# Altium project IMX6ULL_CORE.PrjPcb (part 1 of 2)
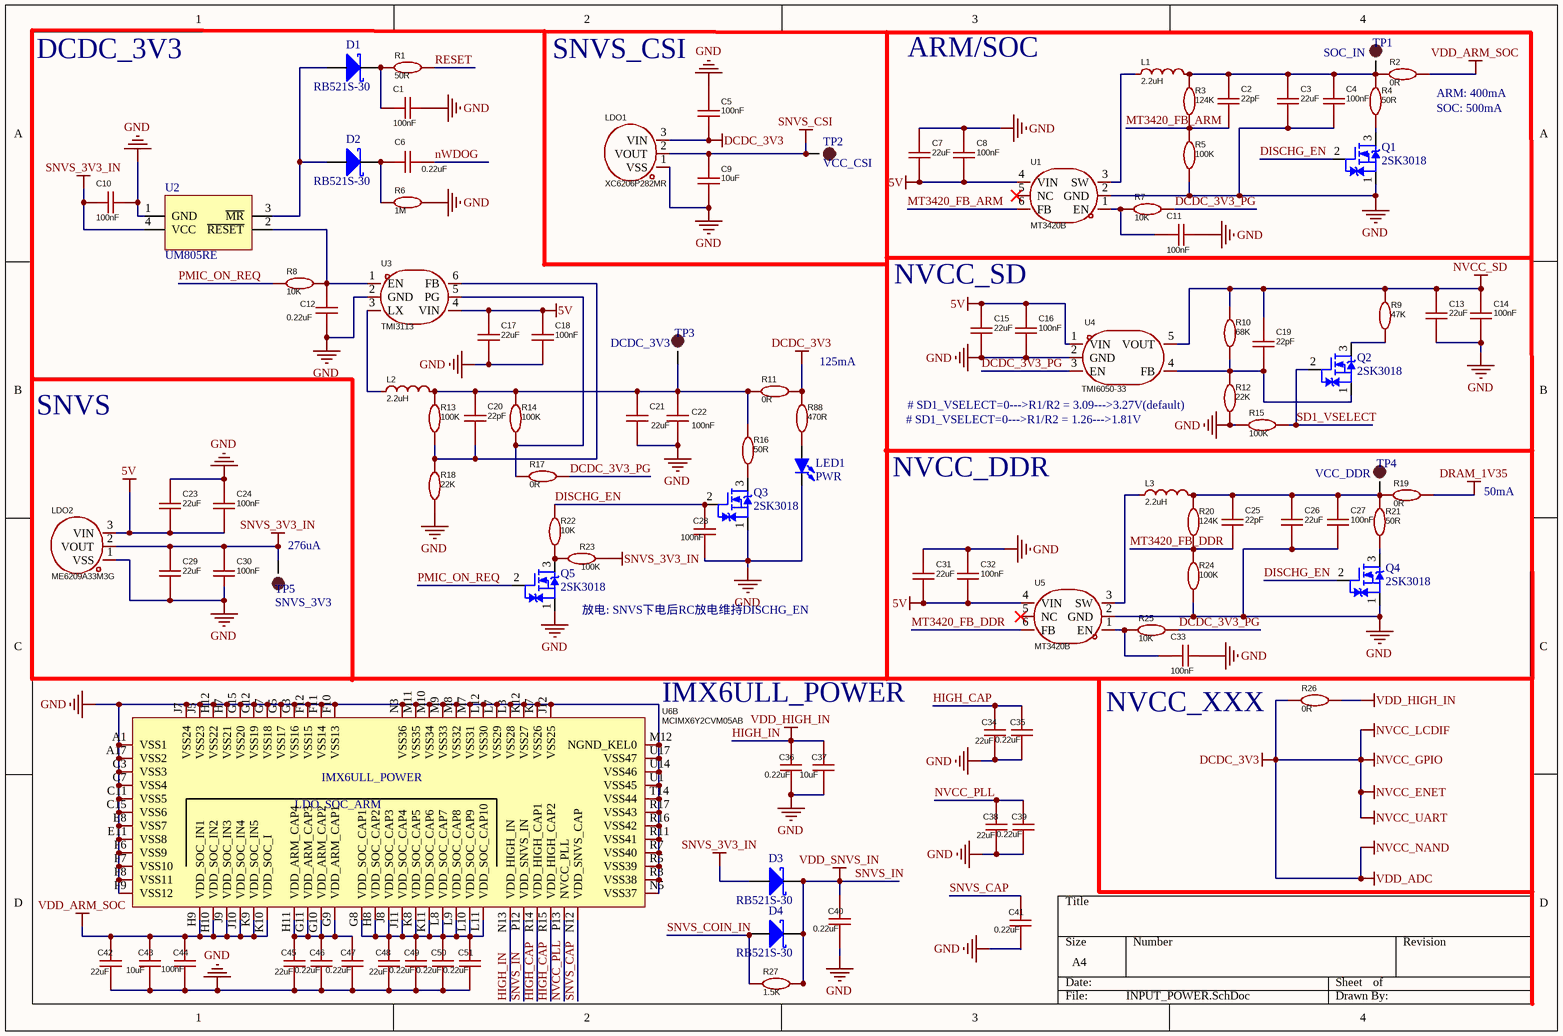
[diagram p0: INPUT_POWER.SchDoc]
5 sheets, 235 parts. Net scope: global (net labels, ports and power ports of the same name join across sheets).
Board file: PCB1.PcbDoc
Sheets:
  INPUT_POWER.SchDoc
  MX6ULL_DDR.SchDoc
  FLASH_CSI.SchDoc
  LCD_NET_GPIO_JTAG_SD_USB.SchDoc
  UART_CONTROL.SchDoc

## Sheet INPUT_POWER.SchDoc
size A4; SheetNumber: 1; SheetTotal: 5

### Parts
C1  100nF  [C0402]
C2  22pF  [C0402]
C3  22uF  [C0603]
C4  100nF  [C0402]
C5  100nF  [C0402]
C6  0.22uF  [C0402]
C7  22uF  [C0603]
C8  100nF  [C0402]
C9  10uF  [C0402]
C10  100nF  [C0402]
C11  100nF  [C0402]
C12  0.22uF  [C0402]
C13  22uF  [C0603]
C14  100nF  [C0402]
C15  22uF  [C0603]
C16  100nF  [C0402]
C17  22uF  [C0603]
C18  100nF  [C0402]
C19  22pF  [C0402]
C20  22pF  [C0402]
C21  22uF  [C0603]
C22  100nF  [C0402]
C23  22uF  [C0603]
C24  100nF  [C0402]
C25  22pF  [C0402]
C26  22uF  [C0603]
C27  100nF  [C0402]
C28  100nF  [C0402]
C29  22uF  [C0603]
C30  100nF  [C0402]
C31  22uF  [C0603]
C32  100nF  [C0402]
C33  100nF  [C0402]
C34  22uF  [C0603]
C35  0.22uF  [C0402]
C36  0.22uF  [C0402]
C37  10uF  [C0402]
C38  22uF  [C0603]
C39  0.22uF  [C0402]
C40  0.22uF  [C0402]
C41  0.22uF  [C0402]
C42  22uF  [C0603]
C43  10uF  [C0402]
C44  100nF  [C0402]
C45  22uF  [C0603]
C46  0.22uF  [C0402]
C47  0.22uF  [C0402]
C48  22uF  [C0603]
C49  0.22uF  [C0402]
C50  0.22uF  [C0402]
C51  0.22uF  [C0402]
D1  RB521S-30  [SOD-523]
D2  RB521S-30  [SOD-523]
D3  RB521S-30  [SOD-523]
D4  RB521S-30  [SOD-523]
L1  2.2uH  [IND-SMD_L2.5-W2.0_MHCHL2520]
L2  2.2uH  [IND-SMD_L2.5-W2.0_MHCHL2520]
L3  2.2uH  [IND-SMD_L2.5-W2.0_MHCHL2520]
LDO1  XC6206P282MR  [SOT-23-3_L2.9-W1.6-P1.90-LS2.8-BR]
LDO2  ME6209A33M3G  [SOT-23-3_L2.9-W1.6-P1.90-LS2.8-BR]
LED1  PWR  [LED 0603B]
Q1  2SK3018  [SC70-3N]
Q2  2SK3018  [SC70-3N]
Q3  2SK3018  [SC70-3N]
Q4  2SK3018  [SC70-3N]
Q5  2SK3018  [SC70-3N]
R1  50R  [R0402]
R2  0R  [R0402]
R3  124K  [R0402]
R4  50R  [R0402]
R5  100K  [R0402]
R6  1M  [R0402]
R7  10K  [R0402]
R8  10K  [R0402]
R9  47K  [R0402]
R10  68K  [R0402]
R11  0R  [R0402]
R12  22K  [R0402]
R13  100K  [R0402]
R14  100K  [R0402]
R15  100K  [R0402]
R16  50R  [R0402]
R17  0R  [R0402]
R18  22K  [R0402]
R19  0R  [R0402]
R20  124K  [R0402]
R21  50R  [R0402]
R22  10K  [R0402]
R23  100K  [R0402]
R24  100K  [R0402]
R25  10K  [R0402]
R26  0R  [R0402]
R27  1.5K  [R0402]
R88  470R  [R0402]
TP1  SOC_IN  [TP-1.0]
TP2  VCC_CSI  [TP-1.0]
TP3  DCDC_3V3  [TP-1.0]
TP4  VCC_DDR  [TP-1.0]
TP5  SNVS_3V3  [TP-1.0]
U1  MT3420B  [SOT-23-6_L2.9-W1.6-P0.95-LS2.8-BL]
U2  UM805RE  [SOT143]
U3  TMI3113  [SOT-23-6_L2.9-W1.6-P0.95-LS2.8-BL]
U4  TMI6050-33  [SOT-23-5_L2.9-W1.6-P0.95-LS2.8-BR]
U5  MT3420B  [SOT-23-6_L2.9-W1.6-P0.95-LS2.8-BL]
U6  MCIMX6Y2CVM05AB  [BGA-289_L14.0-W14.0-R17-C17-P0.80-BL]  (part B of 12)

### Nets
5V: C7.1 C8.1 C15.2 C16.2 C17.2 C18.2 C23.1 C24.1 C31.1 C32.1 LDO2.3(VIN) U1.4(VIN) U3.4(VIN) U4.1(VIN) U5.4(VIN)
DCDC_3V3: C5.2 LDO1.3(VIN) R11.2 R26.1 R88.2  [also labelled NVCC_ENET, NVCC_GPIO, NVCC_LCDIF, NVCC_NAND, NVCC_UART, VDD_ADC]
DRAM_1V35: R19.2
GND: C1.1 C3.1 C4.1 C5.1 C7.2 C8.2 C9.1 C10.1 C11.1 C12.2 C13.1 C14.1 C15.1 C16.1 C17.1 C18.1 C21.1 C22.1 C23.2 C24.2 C26.1 C27.1 C28.1 C29.1 C30.1 C31.2 C32.2 C33.1 C34.1 C35.1 C36.1 C37.1 C38.1 C39.1 C40.1 C41.1 C42.1 C43.1 C44.1 C45.1 C46.1 C47.1 C48.1 C49.1 C50.1 C51.1 LDO1.1(VSS) LDO2.1(VSS) LED1.2(K) Q1.1(S) Q3.1(S) Q4.1(S) Q5.1(S) R5.2 R6.2 R12.2 R15.1 R18.1 R24.2 U1.2(GND) U2.1(GND) U3.2(GND) U4.2(GND) U5.2(GND) U6.A1(VSS1) U6.A17(VSS2) U6.C3(VSS3) U6.C7(VSS4) U6.C11(VSS5) U6.C15(VSS6) U6.E8(VSS7) U6.E11(VSS8) U6.F6(VSS9) U6.F7(VSS10) U6.F8(VSS11) U6.F9(VSS12) U6.F10(VSS13) U6.F11(VSS14) U6.F12(VSS15) U6.G3(VSS16) U6.G5(VSS17) U6.G7(VSS18) U6.G12(VSS19) U6.G15(VSS20) U6.H7(VSS21) U6.H12(VSS22) U6.J5(VSS23) U6.J7(VSS24) U6.J12(VSS25) U6.K7(VSS26) U6.K12(VSS27) U6.L3(VSS28) U6.L7(VSS29) U6.L12(VSS30) U6.M7(VSS31) U6.M8(VSS32) U6.M9(VSS33) U6.M10(VSS34) U6.M11(VSS35) U6.M12(NGND_KEL0) U6.N3(VSS36) U6.N5(VSS37) U6.R3(VSS38) U6.R5(VSS39) U6.R7(VSS40) U6.R11(VSS41) U6.R16(VSS42) U6.R17(VSS43) U6.T14(VSS44) U6.U1(VSS45) U6.U14(VSS46) U6.U17(VSS47)
HIGH_IN: C36.2 C37.2 R26.2 U6.N13(VDD_HIGH_IN)  [also labelled VDD_HIGH_IN]
NVCC_SD: C13.2 C14.2 C19.2 R9.2 R10.1 U4.5(VOUT)
SNVS_3V3_IN: C10.2 C29.2 C30.2 D3.1(A) LDO2.2(VOUT) R23.1 TP5.1 U2.4(VCC)
SNVS_CSI: C9.2 LDO1.2(VOUT) TP2.1
SNVS_IN: C40.2 D3.2(C) D4.2(C) R27.1 U6.P12(VDD_SNVS_IN)  [also labelled VDD_SNVS_IN]
VDD_ARM_SOC: C42.2 C43.2 C44.2 R2.2 U6.H9(VDD_SOC_IN1) U6.H10(VDD_SOC_IN2) U6.J9(VDD_SOC_IN3) U6.J10(VDD_SOC_IN4) U6.K9(VDD_SOC_IN5) U6.K10(VDD_SOC_I)
DCDC_3V3_PG: R7.1 R17.2 R25.1 U4.3(EN)
DISCHG_EN: C28.2 Q1.2(G) Q3.2(G) Q4.2(G) R22.2
HIGH_CAP: C34.2 C35.2 U6.R14(VDD_HIGH_CAP1) U6.R15(VDD_HIGH_CAP2)
MT3420_FB_ARM: C2.1 R3.2 R5.1 U1.6(FB)
MT3420_FB_DDR: C25.1 R20.2 R24.1 U5.6(FB)
NVCC_PLL: C38.2 C39.2 U6.P13(NVCC_PLL)
nWDOG: C6.1
PMIC_ON_REQ: Q5.2(G) R8.1
RESET: R1.2
SD1_VSELECT: Q2.2(G) R15.2  [project net GPIO5]
SNVS_CAP: C41.2 U6.N12(VDD_SNVS_CAP)
SNVS_COIN_IN: D4.1(A) R27.2
NetC1_2: C1.2 D1.2(C) R1.1
NetC2_2: C2.2 C3.2 C4.2 L1.2 R2.1 R3.1 R4.2 TP1.1
NetC6_2: C6.2 D2.2(C) R6.1
NetC11_2: C11.2 R7.2 U1.1(EN)
NetC12_1: C12.1 R8.2 U2.2(~{RESET}) U3.1(EN)
NetC19_1: C19.1 Q2.1(S) R10.2 R12.1 U4.4(FB)
NetC20_1: C20.1 C21.2 C22.2 L2.2 R11.1 R13.2 R14.1 R16.2 TP3.1
NetC20_2: C20.2 R13.1 R18.2 U3.6(FB)
NetC25_2: C25.2 C26.2 C27.2 L3.2 R19.1 R20.1 R21.2 TP4.1
NetC33_2: C33.2 R25.2 U5.1(EN)
NetC45_2: C45.2 C46.2 C47.2 U6.G9(VDD_ARM_CAP1) U6.G10(VDD_ARM_CAP2) U6.G11(VDD_ARM_CAP3) U6.H11(VDD_ARM_CAP4)
NetC48_2: C48.2 C49.2 C50.2 C51.2 U6.G8(VDD_SOC_CAP1) U6.H8(VDD_SOC_CAP2) U6.J8(VDD_SOC_CAP3) U6.J11(VDD_SOC_CAP4) U6.K8(VDD_SOC_CAP5) U6.K11(VDD_SOC_CAP6) U6.L8(VDD_SOC_CAP7) U6.L9(VDD_SOC_CAP8) U6.L10(VDD_SOC_CAP9) U6.L11(VDD_SOC_CAP10)
NetD1_1: D1.1(A) D2.1(A) U2.3(~{MR})
NetL1_1: L1.1 U1.3(SW)
NetL2_1: L2.1 U3.3(LX)
NetL3_1: L3.1 U5.3(SW)
NetLED1_1: LED1.1(A) R88.1
NetQ1_3: Q1.3(D) R4.1
NetQ2_3: Q2.3(D) R9.1
NetQ3_3: Q3.3(D) R16.1
NetQ4_3: Q4.3(D) R21.1
NetQ5_3: Q5.3(D) R22.1 R23.2
NetR14_2: R14.2 R17.1 U3.5(PG)

Not connected (* = marked no-connect by the designer): U1 5(NC)*; U5 5(NC)*

### Notes on the sheet
- DCDC_3V3
- SNVS_CSI
- ARM/SOC
- (near R2) ARM: 400mA
- (near R2) SOC: 500mA
- NVCC_SD
- 125mA
- SNVS
- # SD1_VSELECT=0--->R1/R2 = 1.26--->1.81V
- # SD1_VSELECT=0--->R1/R2 = 3.09--->3.27V(default)
- NVCC_DDR
- 50mA
- (near TP5) 276uA
- (near Q5) 放电: SNVS下电后RC放电维持DISCHG_EN
- (near U6) IMX6ULL_POWER
- (near C33) NVCC_XXX
- (in symbol MCIMX6Y2CVM05AB, part B) IMX6ULL_POWER; LDO_SOC_ARM

### Library data of the parts
C1 C4 C5 C8 C10 C11 C14 C16 C18 C22 C24 C27 C28 C30 C32 C33 C44 = C0402: 容值:100nF;精度:±10%;额定电压:50V;材质(温度系数):X7R;; Manufacturer: muRata(村田); Symbol: GRM155R71H104KE14D; Add into BOM: yes; Tolerance: ±10%; Voltage Rated: 50V; Temperature Coefficient: X7R; Device: GRM155R71H104KE14D; LCSC Part Name: 100nF ±10% 50V; Supplier Part: C77020; Manufacturer Part: GRM155R71H104KE14D; Supplier Footprint: 0402; JLCPCB Part Class: 扩展库; Datasheet: https://atta.szlcsc.com/upload/public/pdf/source/20180326/C77020_39BD49C951FF1AF0DB1F1FAC5AC1E401.pdf; Supplier: LCSC; Convert to PCB: yes; Value: 100nF
C2 C6 C9 C12 C19 C20 C25 C35-C37 C39-C41 C43 C46 C47 C49-C51 = C0402: 容值:100nF;精度:±10%;额定电压:50V;材质(温度系数):X7R;; Manufacturer: muRata(村田); Symbol: GRM155R71H104KE14D; Add into BOM: yes; Value: 100nF; Tolerance: ±10%; Voltage Rated: 50V; Temperature Coefficient: X7R; Device: GRM155R71H104KE14D; LCSC Part Name: 100nF ±10% 50V; Supplier Part: C77020; Manufacturer Part: GRM155R71H104KE14D; Supplier Footprint: 0402; JLCPCB Part Class: 扩展库; Datasheet: https://atta.szlcsc.com/upload/public/pdf/source/20180326/C77020_39BD49C951FF1AF0DB1F1FAC5AC1E401.pdf; Supplier: LCSC; Convert to PCB: yes
C3 C7 C13 C15 C17 C21 C23 C26 C29 C31 C34 C38 C42 C45 C48 = C0603: 容值:22uF;精度:±20%;额定电压:10V;材质(温度系数):X5R;; Manufacturer: Chinocera(华瓷); Symbol: HGC0603R5226M100NTHJ; Add into BOM: yes; Tolerance: ±20%; Voltage Rated: 10V; Temperature Coefficient: X5R; Device: HGC0603R5226M100NTHJ; LCSC Part Name: 22uF ±20% 10V; Supplier Part: C7432770; Manufacturer Part: HGC0603R5226M100NTHJ; Supplier Footprint: 0603; JLCPCB Part Class: 扩展库; Datasheet: https://atta.szlcsc.com/upload/public/pdf/source/20240320/FAC3FEC40A78BC5CCCE96C232A94D860.pdf; Supplier: LCSC; Convert to PCB: yes; Value: 22uF
L1-L3 = L2.5_SMD: 电感值:2.2uH;精度:±20%;额定电流:3A;饱和电流(Isat):3.8A;类型:一体成型电感;; Manufacturer: cjiang(长江微电); Symbol: FTC252012S2R2MBCA; Add into BOM: yes; Tolerance: ±20%; Rated Current: 3A; Saturation Current (Isat): 3.8A; DC Resistance (DCR): 55mΩ; Type: 一体成型电感; Device: FTC252012S2R2MBCA; LCSC Part Name: 2.2uH ±20% 3.8A; Supplier Part: C5832372; Manufacturer Part: FTC252012S2R2MBCA; Supplier Footprint: 1008; JLCPCB Part Class: 扩展库; Datasheet: https://atta.szlcsc.com/upload/public/pdf/source/20230602/8FFEDA9C0247A92A0D4B67554BFE4091.pdf; Supplier: LCSC; Convert to PCB: yes; Value: 2.2uH
LDO1 = XC6206P282MR: 输出类型:固定;最大输入电压:6V;输出电压:3.3V;最大输出电流:250mA;电源纹波抑制比(PSRR):-;输出极性:正极;; Manufacturer: MICRONE(南京微盟); Symbol: ME6209A33M3G; Add into BOM: yes; Output Type: 固定; Maximum Input Voltage: 18V; Output Voltage: 3.3V; MAX Output Current: 250mA; Dropout Voltage: 80mV@(40mA); Output Polarity: 正极; Number of Outputs: 1; Device: ME6209A33M3G; LCSC Part Name: 输入18V 输出3.3V 250mA; Supplier Part: C83508; Manufacturer Part: ME6209A33M3G; Supplier Footprint: SOT-23-3L; JLCPCB Part Class: 扩展库; Datasheet: https://atta.szlcsc.com/upload/public/pdf/source/20161212/1481539101152.pdf; Supplier: LCSC; Convert to PCB: yes; Power Supply Rejection Ratio (PSRR): -
LDO2 = ME6209A33M3G: 输出类型:固定;最大输入电压:18V;输出电压:3.3V;最大输出电流:250mA;电源纹波抑制比(PSRR):-;输出极性:正极;; Manufacturer: MICRONE(南京微盟); Add into BOM: yes; Output Type: 固定; Maximum Input Voltage: 18V; Output Voltage: 3.3V; MAX Output Current: 250mA; Dropout Voltage: 80mV@(40mA); Output Polarity: 正极; Number of Outputs: 1; Symbol: ME6209A33M3G; Device: ME6209A33M3G; LCSC Part Name: 输入18V 输出3.3V 250mA; Supplier Part: C83508; Manufacturer Part: ME6209A33M3G; Supplier Footprint: SOT-23-3L; JLCPCB Part Class: 扩展库; Datasheet: https://atta.szlcsc.com/upload/public/pdf/source/20161212/1481539101152.pdf; Supplier: LCSC; Convert to PCB: yes; Power Supply Rejection Ratio (PSRR): -
LED1 = LED-SMD: 贴片LED; 版权归属: 源创客; BOM名称: 贴片LED; 学习资源: www.ooocke.com
Q1-Q5 = 2SK3018: N沟场效应管  30V,0.1A; 版权归属: 源创客; BOM名称: N沟场效应管; 学习资源: www.ooocke.com
R1-R27 R88 = R0402: 电阻类型:厚膜电阻;阻值:1kΩ;精度:±1%;功率:62.5mW;最大工作电压:50V;温度系数:±100ppm/℃;; Manufacturer: UNI-ROYAL(厚声); Symbol: 0402WGF1001TCE; Add into BOM: yes; Value: 1kΩ; Tolerance: ±1%; Power(Watts): 62.5mW; Overload Voltage (Max): 50V; Device: 0402WGF1001TCE; LCSC Part Name: 1kΩ ±1% 62.5mW 厚膜电阻; Supplier Part: C11702; Manufacturer Part: 0402WGF1001TCE; Supplier Footprint: 0402; JLCPCB Part Class: 基础库; Datasheet: https://atta.szlcsc.com/upload/public/pdf/source/20200306/C422600_1E6D84923E4A46A82E41ADD87F860B5C.pdf; Supplier: LCSC; Convert to PCB: yes; Type: 厚膜电阻; Temperature Coefficient: ±100ppm/℃; Operating Temperature Range: -55℃~+155℃
TP1-TP5 = TEST-POINT: 测试点
U1 U5 = MT3420B: 功能类型:降压型;输出类型:可调;输入电压:2.3V~6V;输出电流:2A;; Manufacturer: 西安航天民芯; Add into BOM: yes; Function: 降压型; Output Type: 可调; Output Current: 2A; Switching Frequency: 1.5MHz; Synchronous Rectification: 是; Number of Outputs: 1; Topology: 降压式; Quiescent Current (Iq): 40uA; Switch tube (built-in/external): 内置; Symbol: MT3420B; Device: MT3420B; LCSC Part Name: 高效率1.5MHz 2A同步降压转换器; Supplier Part: C88169; Manufacturer Part: MT3420B; Supplier Footprint: SOT-23-6; JLCPCB Part Class: 扩展库; Datasheet: https://atta.szlcsc.com/upload/public/pdf/source/20161118/1479432899451.pdf; Supplier: LCSC; Convert to PCB: yes; Input Voltage: 2.3V~6V; Operating Temperature: -40℃~+85℃
U3 = TMI3113: Manufacturer: TMI(拓尔微); Add into BOM: yes; Symbol: TMI3113; Device: TMI3113; LCSC Part Name: 降压电源IC; Supplier Part: C840538; Manufacturer Part: TMI3113; Supplier Footprint: SOT-23-6; JLCPCB Part Class: 扩展库; Datasheet: https://atta.szlcsc.com/upload/public/pdf/source/20240703/C0AA5197CCC5F744B98CE85D643249DC.pdf; Supplier: LCSC; Convert to PCB: yes
U4 = TMI6050-33: 输出类型:-;; Manufacturer: TMI(拓尔微); Add into BOM: yes; Symbol: TMI6050-33; Device: TMI6050-33; LCSC Part Name: TMI6050-33; Supplier Part: C911079; Manufacturer Part: TMI6050-33; Supplier Footprint: SOT-23-5; JLCPCB Part Class: 扩展库; Datasheet: https://atta.szlcsc.com/upload/public/pdf/source/20201021/C883398_061EBE8A1966023595B0BA10A4DBC8BC.pdf; Supplier: LCSC; Convert to PCB: yes; Output Type: -
U6 = MCIMX6Y2CVM05AB: CPU内核:ARM-A系列;RAM总容量:128KB;GPIO端口数量:-;工作电压范围:-;CPU最大主频:528MHz;程序存储器类型:-;应用领域:-;; Manufacturer: NXP(恩智浦); Add into BOM: yes; RAM Size: 128KB; CPU Maximum Speed: 528MHz; ADC (Bit): 12bit; UART/USART: 8; I2C: 4; Universal Serial Bus: 有; Peripheral/Function: 真随机数发生器; Symbol: MCIMX6Y2CVM05AB; Device: MCIMX6Y2CVM05AB; LCSC Part Name: MCIMX6Y2CVM05AB; Supplier Part: C394783; Manufacturer Part: MCIMX6Y2CVM05AB; Supplier Footprint: MAPBGA-289(14x14); JLCPCB Part Class: 扩展库; Datasheet: https://atta.szlcsc.com/upload/public/pdf/source/20190903/C414057_F91A491E37DFDD32A6FE61E7D0CA74B1.pdf; Supplier: LCSC; Convert to PCB: yes; CPU Core: ARM-A系列; GPIO Ports Number: -; Operating Voltage Range: -; Program Memory Type: -; Operating Temperature Range: -40℃~+105℃; DAC (Bit): -; PWM (Bit): -; 8Bit Timer: -; 16Bit Timer: -; 32Bit Timer: -; CAN: -; I2S: -; SPI: 4; Internal Comparator: -; communication protocol: -; Watchdog: -; Real-Time Clock: -; Infrared Data Association: -; Low-Voltage Detect: -; CCP Capture/Compare: -; LCD Module: 有; LED Module: -; Secure Digital Input and Output: -; Direct Memory Access: -; Internal Oscillator: -; Application Area: -

## Sheet MX6ULL_DDR.SchDoc
size A4; SheetNumber: 2; SheetTotal: 5
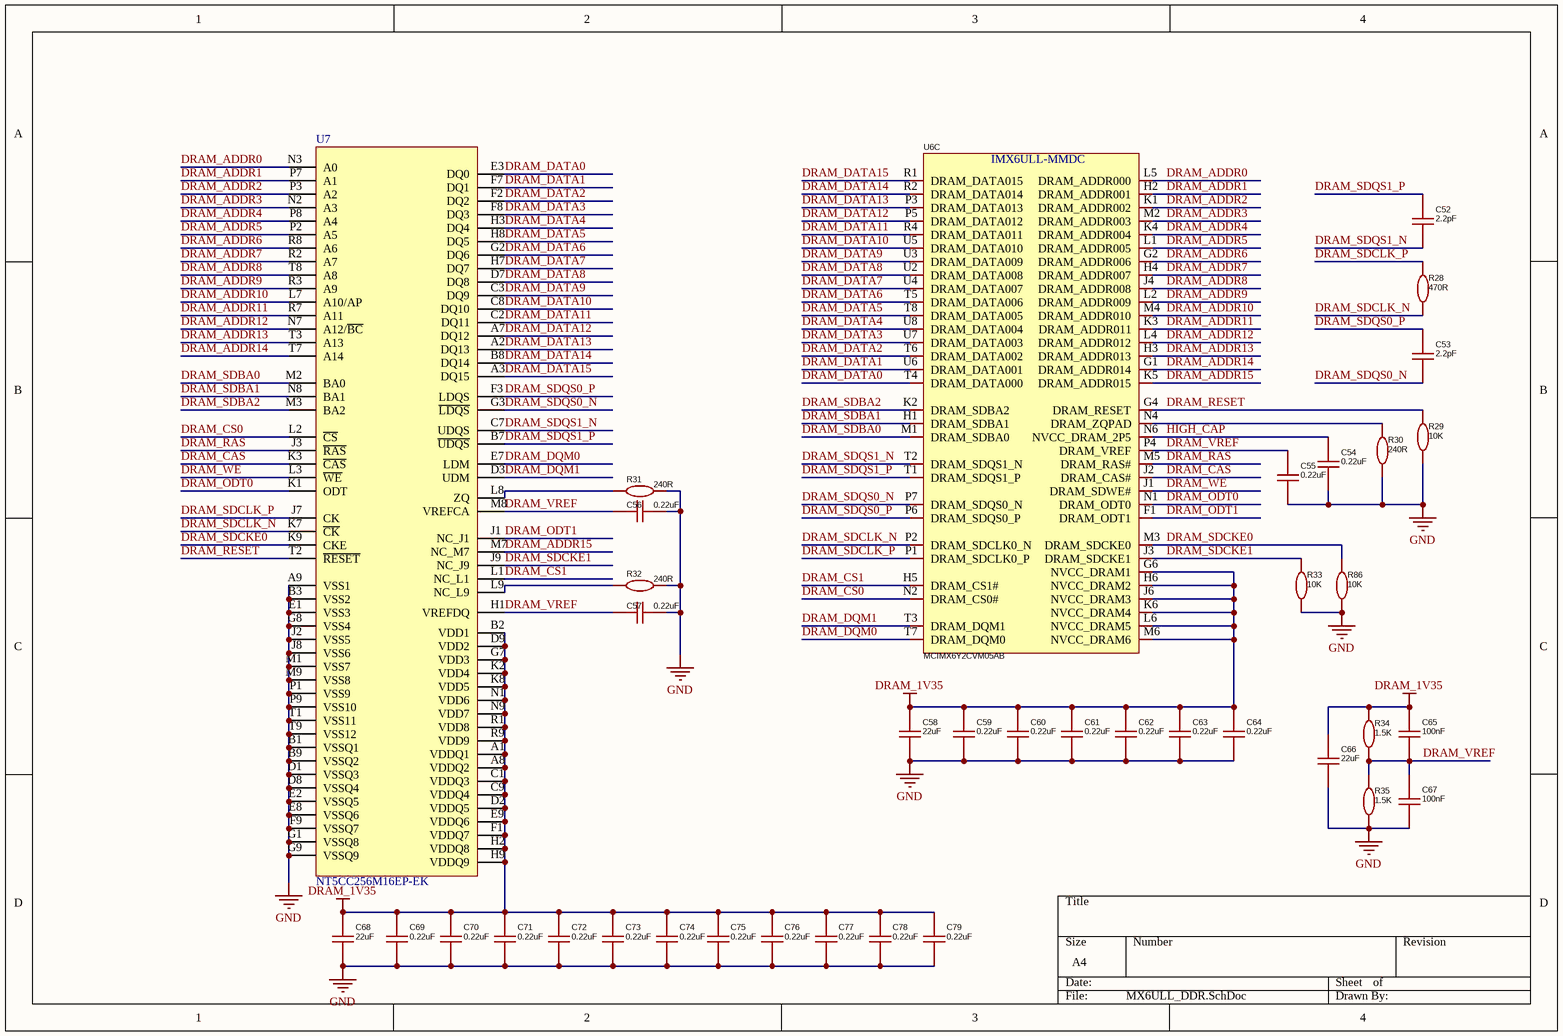
[diagram p1: MX6ULL_DDR.SchDoc]

### Parts
C52  2.2pF  [C0402]
C53  2.2pF  [C0402]
C54  0.22uF  [C0402]
C55  0.22uF  [C0402]
C56  0.22uF  [C0402]
C57  0.22uF  [C0402]
C58  22uF  [C0603]
C59  0.22uF  [C0402]
C60  0.22uF  [C0402]
C61  0.22uF  [C0402]
C62  0.22uF  [C0402]
C63  0.22uF  [C0402]
C64  0.22uF  [C0402]
C65  100nF  [C0402]
C66  22uF  [C0603]
C67  100nF  [C0402]
C68  22uF  [C0603]
C69  0.22uF  [C0402]
C70  0.22uF  [C0402]
C71  0.22uF  [C0402]
C72  0.22uF  [C0402]
C73  0.22uF  [C0402]
C74  0.22uF  [C0402]
C75  0.22uF  [C0402]
C76  0.22uF  [C0402]
C77  0.22uF  [C0402]
C78  0.22uF  [C0402]
C79  0.22uF  [C0402]
R28  470R  [R0402]
R29  10K  [R0402]
R30  240R  [R0402]
R31  240R  [R0402]
R32  240R  [R0402]
R33  10K  [R0402]
R34  1.5K  [R0402]
R35  1.5K  [R0402]
R86  10K  [R0402]
U6  MCIMX6Y2CVM05AB  [BGA-289_L14.0-W14.0-R17-C17-P0.80-BL]  (part C of 12)
U7  NT5CC256M16EP-EK  [TFBGA-96_L13.0-W8.0-R16-C6-P0.80-TL]

### Nets
DRAM_1V35: C58.2 C59.2 C60.2 C61.2 C62.2 C63.2 C64.2 C65.2 C66.2 C68.2 C69.2 C70.2 C71.2 C72.2 C73.2 C74.2 C75.2 C76.2 C77.2 C78.2 C79.2 R34.2 U6.G6(NVCC_DRAM1) U6.H6(NVCC_DRAM2) U6.J6(NVCC_DRAM3) U6.K6(NVCC_DRAM4) U6.L6(NVCC_DRAM5) U6.M6(NVCC_DRAM6) U7.A1(VDDQ1) U7.A8(VDDQ2) U7.B2(VDD1) U7.C1(VDDQ3) U7.C9(VDDQ4) U7.D2(VDDQ5) U7.D9(VDD2) U7.E9(VDDQ6) U7.F1(VDDQ7) U7.G7(VDD3) U7.H2(VDDQ8) U7.H9(VDDQ9) U7.K2(VDD4) U7.K8(VDD5) U7.N1(VDD6) U7.N9(VDD7) U7.R1(VDD8) U7.R9(VDD9)
GND: C54.1 C55.1 C56.1 C57.1 C58.1 C59.1 C60.1 C61.1 C62.1 C63.1 C64.1 C66.1 C67.1 C68.1 C69.1 C70.1 C71.1 C72.1 C73.1 C74.1 C75.1 C76.1 C77.1 C78.1 C79.1 R29.1 R30.1 R31.1 R32.1 R33.1 R35.1 R86.1 U7.A9(VSS1) U7.B1(VSSQ1) U7.B3(VSS2) U7.B9(VSSQ2) U7.D1(VSSQ3) U7.D8(VSSQ4) U7.E1(VSS3) U7.E2(VSSQ5) U7.E8(VSSQ6) U7.F9(VSSQ7) U7.G1(VSSQ8) U7.G8(VSS4) U7.G9(VSSQ9) U7.J2(VSS5) U7.J8(VSS6) U7.M1(VSS7) U7.M9(VSS8) U7.P1(VSS9) U7.P9(VSS10) U7.T1(VSS11) U7.T9(VSS12)
DRAM_ADDR0: U6.L5(DRAM_ADDR000) U7.N3(A0)
DRAM_ADDR1: U6.H2(DRAM_ADDR001) U7.P7(A1)
DRAM_ADDR2: U6.K1(DRAM_ADDR002) U7.P3(A2)
DRAM_ADDR3: U6.M2(DRAM_ADDR003) U7.N2(A3)
DRAM_ADDR4: U6.K4(DRAM_ADDR004) U7.P8(A4)
DRAM_ADDR5: U6.L1(DRAM_ADDR005) U7.P2(A5)
DRAM_ADDR6: U6.G2(DRAM_ADDR006) U7.R8(A6)
DRAM_ADDR7: U6.H4(DRAM_ADDR007) U7.R2(A7)
DRAM_ADDR8: U6.J4(DRAM_ADDR008) U7.T8(A8)
DRAM_ADDR9: U6.L2(DRAM_ADDR009) U7.R3(A9)
DRAM_ADDR10: U6.M4(DRAM_ADDR010) U7.L7(A10/AP)
DRAM_ADDR11: U6.K3(DRAM_ADDR011) U7.R7(A11)
DRAM_ADDR12: U6.L4(DRAM_ADDR012) U7.N7(A12/~{BC})
DRAM_ADDR13: U6.H3(DRAM_ADDR013) U7.T3(A13)
DRAM_ADDR14: U6.G1(DRAM_ADDR014) U7.T7(A14)
DRAM_ADDR15: U6.K5(DRAM_ADDR015) U7.M7(NC_M7)
DRAM_CAS: U6.J2(DRAM_CAS#) U7.K3(~{CAS})
DRAM_CS0: U6.N2(DRAM_CS0#) U7.L2(~{CS})
DRAM_CS1: U6.H5(DRAM_CS1#) U7.L1(NC_L1)
DRAM_DATA0: U6.T4(DRAM_DATA000) U7.E3(DQ0)
DRAM_DATA1: U6.U6(DRAM_DATA001) U7.F7(DQ1)
DRAM_DATA2: U6.T6(DRAM_DATA002) U7.F2(DQ2)
DRAM_DATA3: U6.U7(DRAM_DATA003) U7.F8(DQ3)
DRAM_DATA4: U6.U8(DRAM_DATA004) U7.H3(DQ4)
DRAM_DATA5: U6.T8(DRAM_DATA005) U7.H8(DQ5)
DRAM_DATA6: U6.T5(DRAM_DATA006) U7.G2(DQ6)
DRAM_DATA7: U6.U4(DRAM_DATA007) U7.H7(DQ7)
DRAM_DATA8: U6.U2(DRAM_DATA008) U7.D7(DQ8)
DRAM_DATA9: U6.U3(DRAM_DATA009) U7.C3(DQ9)
DRAM_DATA10: U6.U5(DRAM_DATA010) U7.C8(DQ10)
DRAM_DATA11: U6.R4(DRAM_DATA011) U7.C2(DQ11)
DRAM_DATA12: U6.P5(DRAM_DATA012) U7.A7(DQ12)
DRAM_DATA13: U6.P3(DRAM_DATA013) U7.A2(DQ13)
DRAM_DATA14: U6.R2(DRAM_DATA014) U7.B8(DQ14)
DRAM_DATA15: U6.R1(DRAM_DATA015) U7.A3(DQ15)
DRAM_DQM0: U6.T7(DRAM_DQM0) U7.E7(LDM)
DRAM_DQM1: U6.T3(DRAM_DQM1) U7.D3(UDM)
DRAM_ODT0: U6.N1(DRAM_ODT0) U7.K1(ODT)
DRAM_ODT1: U6.F1(DRAM_ODT1) U7.J1(NC_J1)
DRAM_RAS: U6.M5(DRAM_RAS#) U7.J3(~{RAS})
DRAM_RESET: R29.2 U6.G4(DRAM_RESET) U7.T2(~{RESET})
DRAM_SDBA0: U6.M1(DRAM_SDBA0) U7.M2(BA0)
DRAM_SDBA1: U6.H1(DRAM_SDBA1) U7.N8(BA1)
DRAM_SDBA2: U6.K2(DRAM_SDBA2) U7.M3(BA2)
DRAM_SDCKE0: R86.2 U6.M3(DRAM_SDCKE0) U7.K9(CKE)
DRAM_SDCKE1: R33.2 U6.J3(DRAM_SDCKE1) U7.J9(NC_J9)
DRAM_SDCLK_N: R28.1 U6.P2(DRAM_SDCLK0_N) U7.K7(~{CK})
DRAM_SDCLK_P: R28.2 U6.P1(DRAM_SDCLK0_P) U7.J7(CK)
DRAM_SDQS0_N: C53.1 U6.P7(DRAM_SDQS0_N) U7.G3(~{LDQS})
DRAM_SDQS0_P: C53.2 U6.P6(DRAM_SDQS0_P) U7.F3(LDQS)
DRAM_SDQS1_N: C52.1 U6.T2(DRAM_SDQS1_N) U7.C7(UDQS)
DRAM_SDQS1_P: C52.2 U6.T1(DRAM_SDQS1_P) U7.B7(~{UDQS})
DRAM_VREF: C55.2 C56.2 C57.2 C65.1 C67.2 R34.1 R35.2 U6.P4(DRAM_VREF) U7.H1(VREFDQ) U7.M8(VREFCA)
DRAM_WE: U6.J1(DRAM_SDWE#) U7.L3(~{WE})
HIGH_CAP: C54.2 U6.N6(NVCC_DRAM_2P5)
NetR30_2: R30.2 U6.N4(DRAM_ZQPAD)
NetR31_2: R31.2 U7.L8(ZQ)
NetR32_2: R32.2 U7.L9(NC_L9)

### Notes on the sheet
- (in symbol MCIMX6Y2CVM05AB, part C) IMX6ULL-MMDC

### Library data of the parts
C52-C57 C59-C64 C69-C79 = C0402: as C2 on sheet INPUT_POWER; Device: GRM155R71H104KE14D; LCSC Part Name: 100nF ±10% 50V; Supplier Part: C77020; Manufacturer Part: GRM155R71H104KE14D; Supplier Footprint: 0402; JLCPCB Part Class: 扩展库; Datasheet: https://atta.szlcsc.com/upload/public/pdf/source/20180326/C77020_39BD49C951FF1AF0DB1F1FAC5AC1E401.pdf; Supplier: LCSC; Convert to PCB: yes
C58 C66 C68 = C0603: as C3 on sheet INPUT_POWER; Device: HGC0603R5226M100NTHJ; LCSC Part Name: 22uF ±20% 10V; Supplier Part: C7432770; Manufacturer Part: HGC0603R5226M100NTHJ; Supplier Footprint: 0603; JLCPCB Part Class: 扩展库; Datasheet: https://atta.szlcsc.com/upload/public/pdf/source/20240320/FAC3FEC40A78BC5CCCE96C232A94D860.pdf; Supplier: LCSC; Convert to PCB: yes; Value: 22uF
C65 C67 = C0402: as C1 on sheet INPUT_POWER; Device: GRM155R71H104KE14D; LCSC Part Name: 100nF ±10% 50V; Supplier Part: C77020; Manufacturer Part: GRM155R71H104KE14D; Supplier Footprint: 0402; JLCPCB Part Class: 扩展库; Datasheet: https://atta.szlcsc.com/upload/public/pdf/source/20180326/C77020_39BD49C951FF1AF0DB1F1FAC5AC1E401.pdf; Supplier: LCSC; Convert to PCB: yes; Value: 100nF
R28-R35 R86 = R0402: as R1 on sheet INPUT_POWER; Device: 0402WGF1001TCE; LCSC Part Name: 1kΩ ±1% 62.5mW 厚膜电阻; Supplier Part: C11702; Manufacturer Part: 0402WGF1001TCE; Supplier Footprint: 0402; JLCPCB Part Class: 基础库; Datasheet: https://atta.szlcsc.com/upload/public/pdf/source/20200306/C422600_1E6D84923E4A46A82E41ADD87F860B5C.pdf; Supplier: LCSC; Convert to PCB: yes; Type: 厚膜电阻; Temperature Coefficient: ±100ppm/℃; Operating Temperature Range: -55℃~+155℃
U6 = MCIMX6Y2CVM05AB: as U6 on sheet INPUT_POWER; Symbol: MCIMX6Y2CVM05AB; Device: MCIMX6Y2CVM05AB; LCSC Part Name: MCIMX6Y2CVM05AB; Supplier Part: C394783; Manufacturer Part: MCIMX6Y2CVM05AB; Supplier Footprint: MAPBGA-289(14x14); JLCPCB Part Class: 扩展库; Datasheet: https://atta.szlcsc.com/upload/public/pdf/source/20190903/C414057_F91A491E37DFDD32A6FE61E7D0CA74B1.pdf; Supplier: LCSC; Convert to PCB: yes; CPU Core: ARM-A系列; GPIO Ports Number: -; Operating Voltage Range: -; Program Memory Type: -; Operating Temperature Range: -40℃~+105℃; DAC (Bit): -; PWM (Bit): -; 8Bit Timer: -; 16Bit Timer: -; 32Bit Timer: -; CAN: -; I2S: -; SPI: 4; Internal Comparator: -; communication protocol: -; Watchdog: -; Real-Time Clock: -; Infrared Data Association: -; Low-Voltage Detect: -; CCP Capture/Compare: -; LCD Module: 有; LED Module: -; Secure Digital Input and Output: -; Direct Memory Access: -; Internal Oscillator: -; Application Area: -
U7 = MT41K256M16TW

## Sheet FLASH_CSI.SchDoc
size A4; SheetNumber: 3; SheetTotal: 5
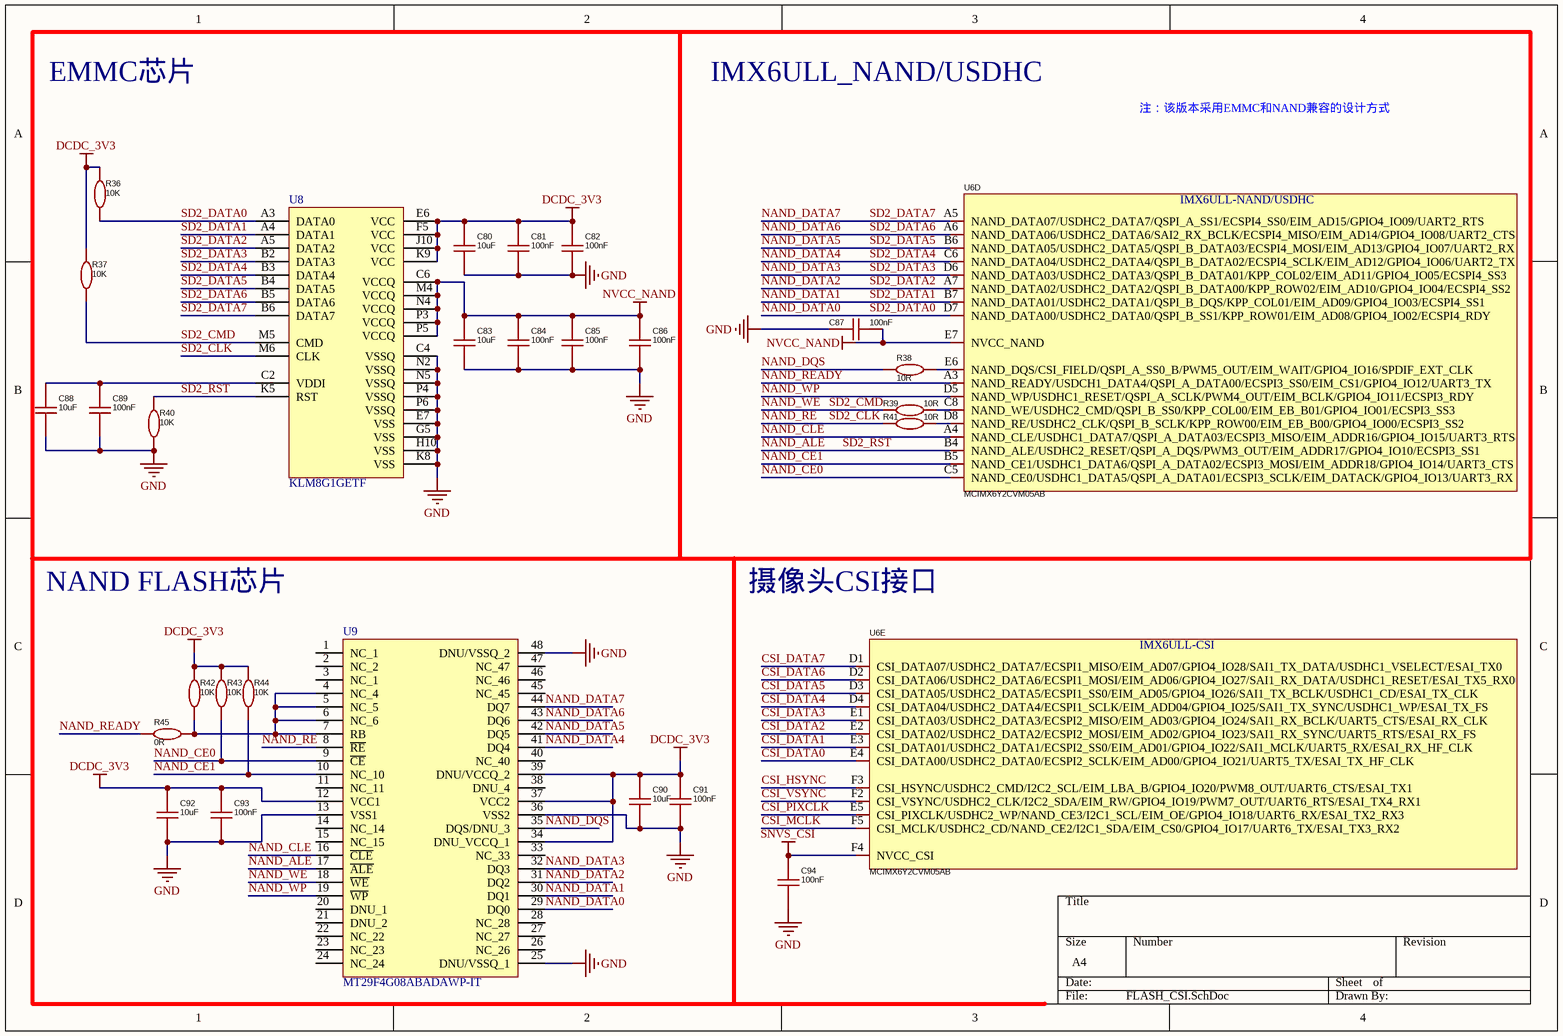
[diagram p2: FLASH_CSI.SchDoc]

### Parts
C80  10uF  [C0402]
C81  100nF  [C0402]
C82  100nF  [C0402]
C83  10uF  [C0402]
C84  100nF  [C0402]
C85  100nF  [C0402]
C86  100nF  [C0402]
C87  100nF  [C0402]
C88  10uF  [C0402]
C89  100nF  [C0402]
C90  10uF  [C0402]
C91  100nF  [C0402]
C92  10uF  [C0402]
C93  100nF  [C0402]
C94  100nF  [C0402]
R36  10K  [R0402]
R37  10K  [R0402]
R38  10R  [R0402]
R39  10R  [R0402]
R40  10K  [R0402]
R41  10R  [R0402]
R42  10K  [R0402]
R43  10K  [R0402]
R44  10K  [R0402]
R45  0R  [R0402]
U6  MCIMX6Y2CVM05AB  [BGA-289_L14.0-W14.0-R17-C17-P0.80-BL]  (parts D,E of 12)
U8  KLM8G1GETF  [BGA169  EMMC]
U9  MT29F4G08ABADAWP-IT  [TSOP48]

### Blocks framed on the sheet
EMMC芯片: C80-C86 C88 C89 R36 R37 R40 U8

### Nets
DCDC_3V3: C80.2 C81.2 C82.2 C83.2 C84.2 C85.2 C86.2 C87.2 C90.2 C91.2 C92.2 C93.2 R36.2 R37.2 R42.2 R43.2 R44.2 U6.E7(NVCC_NAND) U8.C6(VCCQ) U8.E6(VCC) U8.F5(VCC) U8.J10(VCC) U8.K9(VCC) U8.M4(VCCQ) U8.N4(VCCQ) U8.P3(VCCQ) U8.P5(VCCQ) U9.12(VCC1) U9.34(DNU_VCCQ_1) U9.37(VCC2) U9.39(DNU/VCCQ_2)  [also labelled NVCC_NAND]
GND: C80.1 C81.1 C82.1 C83.1 C84.1 C85.1 C86.1 C87.1 C88.1 C89.1 C90.1 C91.1 C92.1 C93.1 C94.1 R40.1 U8.C4(VSSQ) U8.E7(VSS) U8.G5(VSS) U8.H10(VSS) U8.K8(VSS) U8.N2(VSSQ) U8.N5(VSSQ) U8.P4(VSSQ) U8.P6(VSSQ) U9.13(VSS1) U9.25(DNU/VSSQ_1) U9.36(VSS2) U9.48(DNU/VSSQ_2)
SNVS_CSI: C94.2 U6.F4(NVCC_CSI)
CSI_DATA0: U6.E4(CSI_DATA00/USDHC2_DATA0/ECSPI2_SCLK/EIM_AD00/GPIO4_IO21/UART5_TX/ESAI_TX_HF_CLK)
CSI_DATA1: U6.E3(CSI_DATA01/USDHC2_DATA1/ECSPI2_SS0/EIM_AD01/GPIO4_IO22/SAI1_MCLK/UART5_RX/ESAI_RX_HF_CLK)
CSI_DATA2: U6.E2(CSI_DATA02/USDHC2_DATA2/ECSPI2_MOSI/EIM_AD02/GPIO4_IO23/SAI1_RX_SYNC/UART5_RTS/ESAI_RX_FS)
CSI_DATA3: U6.E1(CSI_DATA03/USDHC2_DATA3/ECSPI2_MISO/EIM_AD03/GPIO4_IO24/SAI1_RX_BCLK/UART5_CTS/ESAI_RX_CLK)
CSI_DATA4: U6.D4(CSI_DATA04/USDHC2_DATA4/ECSPI1_SCLK/EIM_ADD04/GPIO4_IO25/SAI1_TX_SYNC/USDHC1_WP/ESAI_TX_FS)
CSI_DATA5: U6.D3(CSI_DATA05/USDHC2_DATA5/ECSPI1_SS0/EIM_AD05/GPIO4_IO26/SAI1_TX_BCLK/USDHC1_CD/ESAI_TX_CLK)
CSI_DATA6: U6.D2(CSI_DATA06/USDHC2_DATA6/ECSPI1_MOSI/EIM_AD06/GPIO4_IO27/SAI1_RX_DATA/USDHC1_RESET/ESAI_TX5_RX0)
CSI_DATA7: U6.D1(CSI_DATA07/USDHC2_DATA7/ECSPI1_MISO/EIM_AD07/GPIO4_IO28/SAI1_TX_DATA/USDHC1_VSELECT/ESAI_TX0)
CSI_HSYNC: U6.F3(CSI_HSYNC/USDHC2_CMD/I2C2_SCL/EIM_LBA_B/GPIO4_IO20/PWM8_OUT/UART6_CTS/ESAI_TX1)
CSI_MCLK: U6.F5(CSI_MCLK/USDHC2_CD/NAND_CE2/I2C1_SDA/EIM_CS0/GPIO4_IO17/UART6_TX/ESAI_TX3_RX2)
CSI_PIXCLK: U6.E5(CSI_PIXCLK/USDHC2_WP/NAND_CE3/I2C1_SCL/EIM_OE/GPIO4_IO18/UART6_RX/ESAI_TX2_RX3)
CSI_VSYNC: U6.F2(CSI_VSYNC/USDHC2_CLK/I2C2_SDA/EIM_RW/GPIO4_IO19/PWM7_OUT/UART6_RTS/ESAI_TX4_RX1)
NAND_ALE: R40.2 U6.B4(NAND_ALE/USDHC2_RESET/QSPI_A_DQS/PWM3_OUT/EIM_ADDR17/GPIO4_IO10/ECSPI3_SS1) U8.K5(RST) U9.17(~{ALE})  [also labelled SD2_RST]
NAND_CE0: R43.1 U6.C5(NAND_CE0/USDHC1_DATA5/QSPI_A_DATA01/ECSPI3_SCLK/EIM_DATACK/GPIO4_IO13/UART3_RX) U9.9(~{CE})
NAND_CE1: R44.1 U6.B5(NAND_CE1/USDHC1_DATA6/QSPI_A_DATA02/ECSPI3_MOSI/EIM_ADDR18/GPIO4_IO14/UART3_CTS) U9.10(NC_10)
NAND_CLE: U6.A4(NAND_CLE/USDHC1_DATA7/QSPI_A_DATA03/ECSPI3_MISO/EIM_ADDR16/GPIO4_IO15/UART3_RTS) U9.16(~{CLE})
NAND_DATA0: R36.1 U6.D7(NAND_DATA00/USDHC2_DATA0/QSPI_B_SS1/KPP_ROW01/EIM_AD08/GPIO4_IO02/ECSPI4_RDY) U8.A3(DATA0) U9.29(DQ0)  [also labelled SD2_DATA0]
NAND_DATA1: U6.B7(NAND_DATA01/USDHC2_DATA1/QSPI_B_DQS/KPP_COL01/EIM_AD09/GPIO4_IO03/ECSPI4_SS1) U8.A4(DATA1) U9.30(DQ1)  [also labelled SD2_DATA1]
NAND_DATA2: U6.A7(NAND_DATA02/USDHC2_DATA2/QSPI_B_DATA00/KPP_ROW02/EIM_AD10/GPIO4_IO04/ECSPI4_SS2) U8.A5(DATA2) U9.31(DQ2)  [also labelled SD2_DATA2]
NAND_DATA3: U6.D6(NAND_DATA03/USDHC2_DATA3/QSPI_B_DATA01/KPP_COL02/EIM_AD11/GPIO4_IO05/ECSPI4_SS3) U8.B2(DATA3) U9.32(DQ3)  [also labelled SD2_DATA3]
NAND_DATA4: U6.C6(NAND_DATA04/USDHC2_DATA4/QSPI_B_DATA02/ECSPI4_SCLK/EIM_AD12/GPIO4_IO06/UART2_TX) U8.B3(DATA4) U9.41(DQ4)  [also labelled SD2_DATA4]
NAND_DATA5: U6.B6(NAND_DATA05/USDHC2_DATA5/QSPI_B_DATA03/ECSPI4_MOSI/EIM_AD13/GPIO4_IO07/UART2_RX) U8.B4(DATA5) U9.42(DQ5)  [also labelled SD2_DATA5]
NAND_DATA6: U6.A6(NAND_DATA06/USDHC2_DATA6/SAI2_RX_BCLK/ECSPI4_MISO/EIM_AD14/GPIO4_IO08/UART2_CTS) U8.B5(DATA6) U9.43(DQ6)  [also labelled SD2_DATA6]
NAND_DATA7: U6.A5(NAND_DATA07/USDHC2_DATA7/QSPI_A_SS1/ECSPI4_SS0/EIM_AD15/GPIO4_IO09/UART2_RTS) U8.B6(DATA7) U9.44(DQ7)  [also labelled SD2_DATA7]
NAND_DQS: R38.1 U9.35(DQS/DNU_3)
NAND_RE: R41.1 U8.M6(CLK) U9.8(~{RE})  [also labelled SD2_CLK]
NAND_READY: R45.2 U6.A3(NAND_READY/USDCH1_DATA4/QSPI_A_DATA00/ECSPI3_SS0/EIM_CS1/GPIO4_IO12/UART3_TX)
NAND_WE: R37.1 R39.1 U8.M5(CMD) U9.18(~{WE})  [also labelled SD2_CMD]
NAND_WP: U6.D5(NAND_WP/USDHC1_RESET/QSPI_A_SCLK/PWM4_OUT/EIM_BCLK/GPIO4_IO11/ECSPI3_RDY) U9.19(~{WP})
NetC88_2: C88.2 C89.2 U8.C2(VDDI)
NetR38_2: R38.2 U6.E6(NAND_DQS/CSI_FIELD/QSPI_A_SS0_B/PWM5_OUT/EIM_WAIT/GPIO4_IO16/SPDIF_EXT_CLK)
NetR39_2: R39.2 U6.C8(NAND_WE/USDHC2_CMD/QSPI_B_SS0/KPP_COL00/EIM_EB_B01/GPIO4_IO01/ECSPI3_SS3)
NetR41_2: R41.2 U6.D8(NAND_RE/USDHC2_CLK/QSPI_B_SCLK/KPP_ROW00/EIM_EB_B00/GPIO4_IO00/ECSPI3_SS2)
NetR42_1: R42.1 R45.1 U9.4(NC_4) U9.5(NC_5) U9.6(NC_6) U9.7(RB)

Not connected (* = marked no-connect by the designer): U9 1(NC_1) 2(NC_2) 3(NC_1) 11(NC_11) 14(NC_14) 15(NC_15) 20(DNU_1) 21(DNU_2) 22(NC_22) 23(NC_23) 24(NC_24) 26(NC_26) 27(NC_27) 28(NC_28) 33(NC_33) 38(DNU_4) 40(NC_40) 45(NC_45) 46(NC_46) 47(NC_47)

### Notes on the sheet
- IMX6ULL_NAND/USDHC
- 注：该版本采用EMMC和NAND兼容的设计方式
- NAND FLASH芯片
- 摄像头CSI接口
- (in symbol MCIMX6Y2CVM05AB, part D) IMX6ULL-NAND/USDHC
- (in symbol MCIMX6Y2CVM05AB, part E) IMX6ULL-CSI

### Library data of the parts
C80 C83 C88 C90 C92 = C0402: as C2 on sheet INPUT_POWER; Device: GRM155R71H104KE14D; LCSC Part Name: 100nF ±10% 50V; Supplier Part: C77020; Manufacturer Part: GRM155R71H104KE14D; Supplier Footprint: 0402; JLCPCB Part Class: 扩展库; Datasheet: https://atta.szlcsc.com/upload/public/pdf/source/20180326/C77020_39BD49C951FF1AF0DB1F1FAC5AC1E401.pdf; Supplier: LCSC; Convert to PCB: yes
C81 C82 C84-C87 C89 C91 C93 C94 = C0402: as C1 on sheet INPUT_POWER; Device: GRM155R71H104KE14D; LCSC Part Name: 100nF ±10% 50V; Supplier Part: C77020; Manufacturer Part: GRM155R71H104KE14D; Supplier Footprint: 0402; JLCPCB Part Class: 扩展库; Datasheet: https://atta.szlcsc.com/upload/public/pdf/source/20180326/C77020_39BD49C951FF1AF0DB1F1FAC5AC1E401.pdf; Supplier: LCSC; Convert to PCB: yes; Value: 100nF
R36-R45 = R0402: as R1 on sheet INPUT_POWER; Device: 0402WGF1001TCE; LCSC Part Name: 1kΩ ±1% 62.5mW 厚膜电阻; Supplier Part: C11702; Manufacturer Part: 0402WGF1001TCE; Supplier Footprint: 0402; JLCPCB Part Class: 基础库; Datasheet: https://atta.szlcsc.com/upload/public/pdf/source/20200306/C422600_1E6D84923E4A46A82E41ADD87F860B5C.pdf; Supplier: LCSC; Convert to PCB: yes; Type: 厚膜电阻; Temperature Coefficient: ±100ppm/℃; Operating Temperature Range: -55℃~+155℃
U6 = MCIMX6Y2CVM05AB: as U6 on sheet INPUT_POWER; Symbol: MCIMX6Y2CVM05AB; Device: MCIMX6Y2CVM05AB; LCSC Part Name: MCIMX6Y2CVM05AB; Supplier Part: C394783; Manufacturer Part: MCIMX6Y2CVM05AB; Supplier Footprint: MAPBGA-289(14x14); JLCPCB Part Class: 扩展库; Datasheet: https://atta.szlcsc.com/upload/public/pdf/source/20190903/C414057_F91A491E37DFDD32A6FE61E7D0CA74B1.pdf; Supplier: LCSC; Convert to PCB: yes; CPU Core: ARM-A系列; GPIO Ports Number: -; Operating Voltage Range: -; Program Memory Type: -; Operating Temperature Range: -40℃~+105℃; DAC (Bit): -; PWM (Bit): -; 8Bit Timer: -; 16Bit Timer: -; 32Bit Timer: -; CAN: -; I2S: -; SPI: 4; Internal Comparator: -; communication protocol: -; Watchdog: -; Real-Time Clock: -; Infrared Data Association: -; Low-Voltage Detect: -; CCP Capture/Compare: -; LCD Module: 有; LED Module: -; Secure Digital Input and Output: -; Direct Memory Access: -; Internal Oscillator: -; Application Area: -
U8 = THGBM4G5D1HBAIR/4GB
U9 = MT29F16G16G08CBACA

## Sheet LCD_NET_GPIO_JTAG_SD_USB.SchDoc
size A4; SheetNumber: 4; SheetTotal: 5
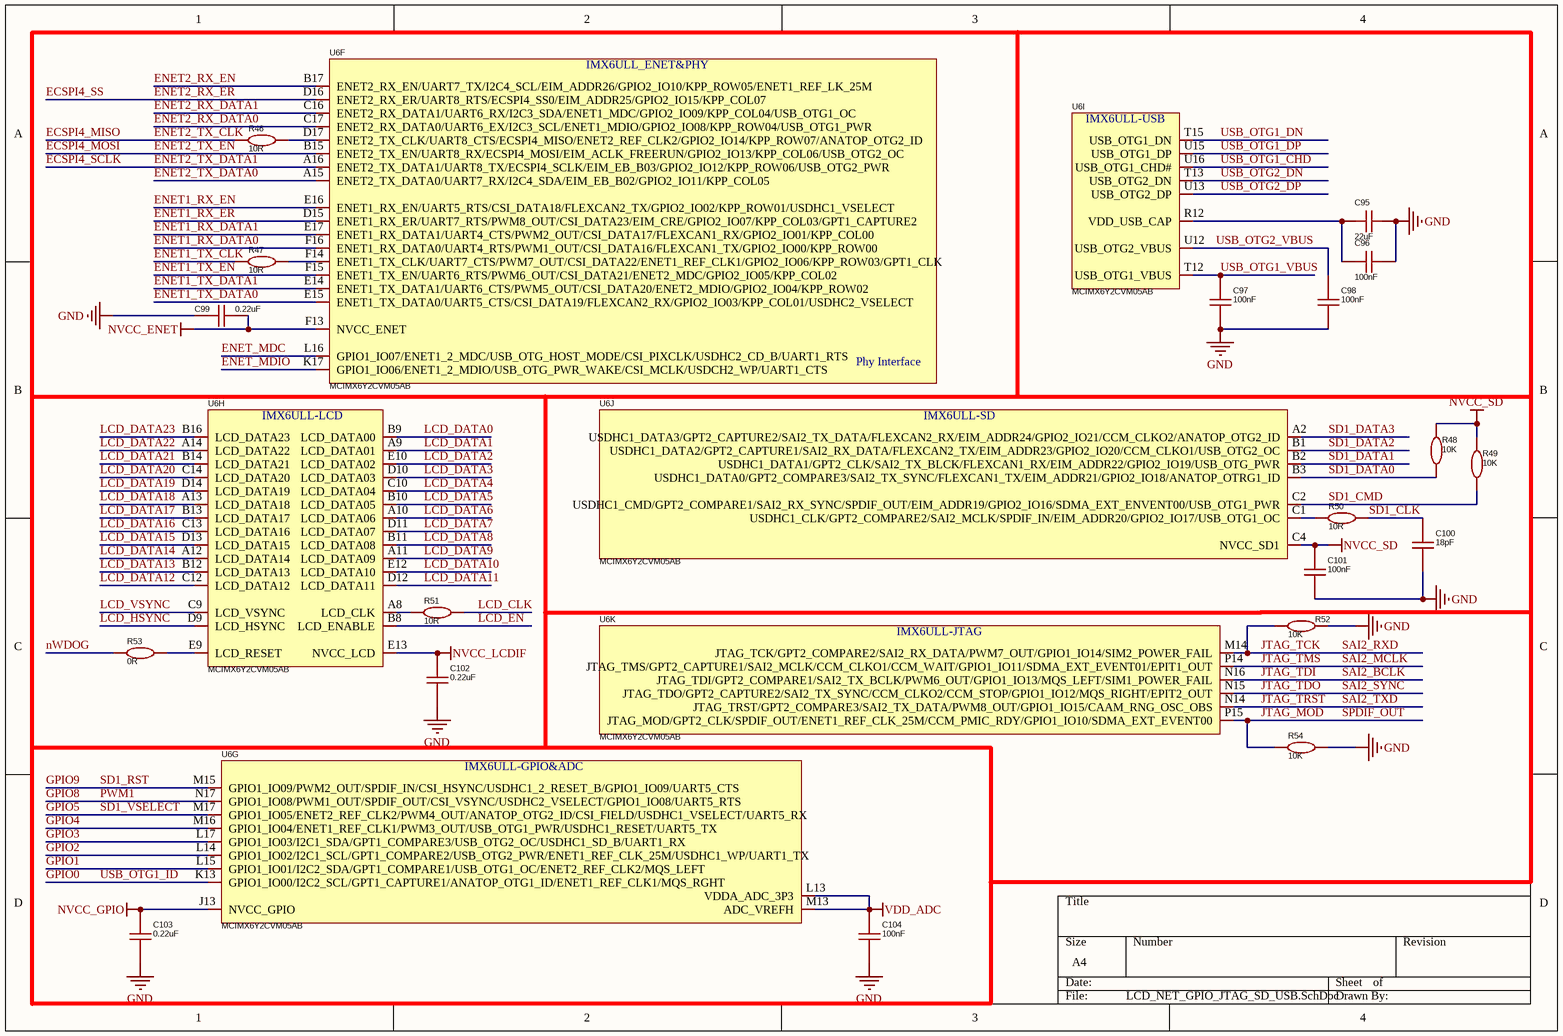
[diagram p3: LCD_NET_GPIO_JTAG_SD_USB.SchDoc]

### Parts
C95  22uF  [C0603]
C96  100nF  [C0402]
C97  100nF  [C0402]
C98  100nF  [C0402]
C99  0.22uF  [C0402]
C100  18pF  [C0402]
C101  100nF  [C0402]
C102  0.22uF  [C0402]
C103  0.22uF  [C0402]
C104  100nF  [C0402]
R46  10R  [R0402]
R47  10R  [R0402]
R48  10K  [R0402]
R49  10K  [R0402]
R50  10R  [R0402]
R51  10R  [R0402]
R52  10K  [R0402]
R53  0R  [R0402]
R54  10K  [R0402]
U6  MCIMX6Y2CVM05AB  [BGA-289_L14.0-W14.0-R17-C17-P0.80-BL]  (parts F,G,H,I,J,K of 12)

### Nets
GND: C95.2 C96.2 C97.1 C98.1 C99.2 C100.1 C101.1 C102.2 C103.2 C104.1 R52.1 R54.1
NVCC_ENET: C99.1 C102.1 C103.1 C104.2 U6.E13(NVCC_LCD) U6.F13(NVCC_ENET) U6.J13(NVCC_GPIO) U6.L13(VDDA_ADC_3P3) U6.M13(ADC_VREFH)  [also labelled NVCC_GPIO, NVCC_LCDIF, VDD_ADC]  [project net DCDC_3V3]
NVCC_SD: C101.2 R48.2 R49.2 U6.C4(NVCC_SD1)
ECSPI4_MISO: R46.1  [also labelled ENET2_TX_CLK]
ECSPI4_MOSI: U6.B15(ENET2_TX_EN/UART8_RX/ECSPI4_MOSI/EIM_ACLK_FREERUN/GPIO2_IO13/KPP_COL06/USB_OTG2_OC)  [also labelled ENET2_TX_EN]
ECSPI4_SCLK: U6.A16(ENET2_TX_DATA1/UART8_TX/ECSPI4_SCLK/EIM_EB_B03/GPIO2_IO12/KPP_ROW06/USB_OTG2_PWR)  [also labelled ENET2_TX_DATA1]
ECSPI4_SS: U6.D16(ENET2_RX_ER/UART8_RTS/ECSPI4_SS0/EIM_ADDR25/GPIO2_IO15/KPP_COL07)  [also labelled ENET2_RX_ER]
ENET1_RX_DATA0: U6.F16(ENET1_RX_DATA0/UART4_RTS/PWM1_OUT/CSI_DATA16/FLEXCAN1_TX/GPIO2_IO00/KPP_ROW00)
ENET1_RX_DATA1: U6.E17(ENET1_RX_DATA1/UART4_CTS/PWM2_OUT/CSI_DATA17/FLEXCAN1_RX/GPIO2_IO01/KPP_COL00)
ENET1_RX_EN: U6.E16(ENET1_RX_EN/UART5_RTS/CSI_DATA18/FLEXCAN2_TX/GPIO2_IO02/KPP_ROW01/USDHC1_VSELECT)
ENET1_RX_ER: U6.D15(ENET1_RX_ER/UART7_RTS/PWM8_OUT/CSI_DATA23/EIM_CRE/GPIO2_IO07/KPP_COL03/GPT1_CAPTURE2)
ENET1_TX_CLK: R47.1
ENET1_TX_DATA0: U6.E15(ENET1_TX_DATA0/UART5_CTS/CSI_DATA19/FLEXCAN2_RX/GPIO2_IO03/KPP_COL01/USDHC2_VSELECT)
ENET1_TX_DATA1: U6.E14(ENET1_TX_DATA1/UART6_CTS/PWM5_OUT/CSI_DATA20/ENET2_MDIO/GPIO2_IO04/KPP_ROW02)
ENET1_TX_EN: U6.F15(ENET1_TX_EN/UART6_RTS/PWM6_OUT/CSI_DATA21/ENET2_MDC/GPIO2_IO05/KPP_COL02)
ENET2_RX_DATA0: U6.C17(ENET2_RX_DATA0/UART6_EX/I2C3_SCL/ENET1_MDIO/GPIO2_IO08/KPP_ROW04/USB_OTG1_PWR)
ENET2_RX_DATA1: U6.C16(ENET2_RX_DATA1/UART6_RX/I2C3_SDA/ENET1_MDC/GPIO2_IO09/KPP_COL04/USB_OTG1_OC)
ENET2_RX_EN: U6.B17(ENET2_RX_EN/UART7_TX/I2C4_SCL/EIM_ADDR26/GPIO2_IO10/KPP_ROW05/ENET1_REF_LK_25M)
ENET2_TX_DATA0: U6.A15(ENET2_TX_DATA0/UART7_RX/I2C4_SDA/EIM_EB_B02/GPIO2_IO11/KPP_COL05)
ENET_MDC: U6.L16(GPIO1_IO07/ENET1_2_MDC/USB_OTG_HOST_MODE/CSI_PIXCLK/USDHC2_CD_B/UART1_RTS)
ENET_MDIO: U6.K17(GPIO1_IO06/ENET1_2_MDIO/USB_OTG_PWR_WAKE/CSI_MCLK/USDCH2_WP/UART1_CTS)
GPIO0: U6.K13(GPIO1_IO00/I2C2_SCL/GPT1_CAPTURE1/ANATOP_OTG1_ID/ENET1_REF_CLK1/MQS_RGHT)  [also labelled USB_OTG1_ID]
GPIO1: U6.L15(GPIO1_IO01/I2C2_SDA/GPT1_COMPARE1/USB_OTG1_OC/ENET2_REF_CLK2/MQS_LEFT)
GPIO2: U6.L14(GPIO1_IO02/I2C1_SCL/GPT1_COMPARE2/USB_OTG2_PWR/ENET1_REF_CLK_25M/USDHC1_WP/UART1_TX)
GPIO3: U6.L17(GPIO1_IO03/I2C1_SDA/GPT1_COMPARE3/USB_OTG2_OC/USDHC1_SD_B/UART1_RX)
GPIO4: U6.M16(GPIO1_IO04/ENET1_REF_CLK1/PWM3_OUT/USB_OTG1_PWR/USDHC1_RESET/UART5_TX)
GPIO5: U6.M17(GPIO1_IO05/ENET2_REF_CLK2/PWM4_OUT/ANATOP_OTG2_ID/CSI_FIELD/USDHC1_VSELECT/UART5_RX)  [also labelled SD1_VSELECT]
GPIO8: U6.N17(GPIO1_IO08/PWM1_OUT/SPDIF_OUT/CSI_VSYNC/USDHC2_VSELECT/GPIO1_IO08/UART5_RTS)  [also labelled PWM1]
GPIO9: U6.M15(GPIO1_IO09/PWM2_OUT/SPDIF_IN/CSI_HSYNC/USDHC1_2_RESET_B/GPIO1_IO09/UART5_CTS)  [also labelled SD1_RST]
JTAG_MOD: R54.2 U6.P15(JTAG_MOD/GPT2_CLK/SPDIF_OUT/ENET1_REF_CLK_25M/CCM_PMIC_RDY/GPIO1_IO10/SDMA_EXT_EVENT00)  [also labelled SPDIF_OUT]
JTAG_TCK: R52.2 U6.M14(JTAG_TCK/GPT2_COMPARE2/SAI2_RX_DATA/PWM7_OUT/GPIO1_IO14/SIM2_POWER_FAIL)  [also labelled SAI2_RXD]
JTAG_TDI: U6.N16(JTAG_TDI/GPT2_COMPARE1/SAI2_TX_BCLK/PWM6_OUT/GPIO1_IO13/MQS_LEFT/SIM1_POWER_FAIL)  [also labelled SAI2_BCLK]
JTAG_TDO: U6.N15(JTAG_TDO/GPT2_CAPTURE2/SAI2_TX_SYNC/CCM_CLKO2/CCM_STOP/GPIO1_IO12/MQS_RIGHT/EPIT2_OUT)  [also labelled SAI2_SYNC]
JTAG_TMS: U6.P14(JTAG_TMS/GPT2_CAPTURE1/SAI2_MCLK/CCM_CLKO1/CCM_WAIT/GPIO1_IO11/SDMA_EXT_EVENT01/EPIT1_OUT)  [also labelled SAI2_MCLK]
JTAG_TRST: U6.N14(JTAG_TRST/GPT2_COMPARE3/SAI2_TX_DATA/PWM8_OUT/GPIO1_IO15/CAAM_RNG_OSC_OBS)  [also labelled SAI2_TXD]
LCD_CLK: R51.2
LCD_DATA0: U6.B9(LCD_DATA00)
LCD_DATA1: U6.A9(LCD_DATA01)
LCD_DATA2: U6.E10(LCD_DATA02)
LCD_DATA3: U6.D10(LCD_DATA03)
LCD_DATA4: U6.C10(LCD_DATA04)
LCD_DATA5: U6.B10(LCD_DATA05)
LCD_DATA6: U6.A10(LCD_DATA06)
LCD_DATA7: U6.D11(LCD_DATA07)
LCD_DATA8: U6.B11(LCD_DATA08)
LCD_DATA9: U6.A11(LCD_DATA09)
LCD_DATA10: U6.E12(LCD_DATA10)
LCD_DATA11: U6.D12(LCD_DATA11)
LCD_DATA12: U6.C12(LCD_DATA12)
LCD_DATA13: U6.B12(LCD_DATA13)
LCD_DATA14: U6.A12(LCD_DATA14)
LCD_DATA15: U6.D13(LCD_DATA15)
LCD_DATA16: U6.C13(LCD_DATA16)
LCD_DATA17: U6.B13(LCD_DATA17)
LCD_DATA18: U6.A13(LCD_DATA18)
LCD_DATA19: U6.D14(LCD_DATA19)
LCD_DATA20: U6.C14(LCD_DATA20)
LCD_DATA21: U6.B14(LCD_DATA21)
LCD_DATA22: U6.A14(LCD_DATA22)
LCD_DATA23: U6.B16(LCD_DATA23)
LCD_EN: U6.B8(LCD_ENABLE)
LCD_HSYNC: U6.D9(LCD_HSYNC)
LCD_VSYNC: U6.C9(LCD_VSYNC)
nWDOG: R53.1
SD1_CLK: C100.2 R50.2
SD1_CMD: R49.1 U6.C2(USDHC1_CMD/GPT2_COMPARE1/SAI2_RX_SYNC/SPDIF_OUT/EIM_ADDR19/GPIO2_IO16/SDMA_EXT_ENVENT00/USB_OTG1_PWR)
SD1_DATA0: R48.1 U6.B3(USDHC1_DATA0/GPT2_COMPARE3/SAI2_TX_SYNC/FLEXCAN1_TX/EIM_ADDR21/GPIO2_IO18/ANATOP_OTRG1_ID)
SD1_DATA1: U6.B2(USDHC1_DATA1/GPT2_CLK/SAI2_TX_BLCK/FLEXCAN1_RX/EIM_ADDR22/GPIO2_IO19/USB_OTG_PWR)
SD1_DATA2: U6.B1(USDHC1_DATA2/GPT2_CAPTURE1/SAI2_RX_DATA/FLEXCAN2_TX/EIM_ADDR23/GPIO2_IO20/CCM_CLKO1/USB_OTG2_OC)
SD1_DATA3: U6.A2(USDHC1_DATA3/GPT2_CAPTURE2/SAI2_TX_DATA/FLEXCAN2_RX/EIM_ADDR24/GPIO2_IO21/CCM_CLKO2/ANATOP_OTG2_ID)
USB_OTG1_CHD: U6.U16(USB_OTG1_CHD#)
USB_OTG1_DN: U6.T15(USB_OTG1_DN)
USB_OTG1_DP: U6.U15(USB_OTG1_DP)
USB_OTG1_VBUS: C97.2 U6.T12(USB_OTG1_VBUS)
USB_OTG2_DN: U6.T13(USB_OTG2_DN)
USB_OTG2_DP: U6.U13(USB_OTG2_DP)
USB_OTG2_VBUS: C98.2 U6.U12(USB_OTG2_VBUS)
NetC95_1: C95.1 C96.1 U6.R12(VDD_USB_CAP)
NetR46_2: R46.2 U6.D17(ENET2_TX_CLK/UART8_CTS/ECSPI4_MISO/ENET2_REF_CLK2/GPIO2_IO14/KPP_ROW07/ANATOP_OTG2_ID)
NetR47_2: R47.2 U6.F14(ENET1_TX_CLK/UART7_CTS/PWM7_OUT/CSI_DATA22/ENET1_REF_CLK1/GPIO2_IO06/KPP_ROW03/GPT1_CLK)
NetR50_1: R50.1 U6.C1(USDHC1_CLK/GPT2_COMPARE2/SAI2_MCLK/SPDIF_IN/EIM_ADDR20/GPIO2_IO17/USB_OTG1_OC)
NetR51_1: R51.1 U6.A8(LCD_CLK)
NetR53_2: R53.2 U6.E9(LCD_RESET)

### Notes on the sheet
- (in symbol MCIMX6Y2CVM05AB, part F) IMX6ULL_ENET&PHY; Phy Interface
- (in symbol MCIMX6Y2CVM05AB, part G) IMX6ULL-GPIO&ADC
- (in symbol MCIMX6Y2CVM05AB, part H) IMX6ULL-LCD
- (in symbol MCIMX6Y2CVM05AB, part I) IMX6ULL-USB
- (in symbol MCIMX6Y2CVM05AB, part J) IMX6ULL-SD
- (in symbol MCIMX6Y2CVM05AB, part K) IMX6ULL-JTAG

### Library data of the parts
C95 = C0603: as C3 on sheet INPUT_POWER; Device: HGC0603R5226M100NTHJ; LCSC Part Name: 22uF ±20% 10V; Supplier Part: C7432770; Manufacturer Part: HGC0603R5226M100NTHJ; Supplier Footprint: 0603; JLCPCB Part Class: 扩展库; Datasheet: https://atta.szlcsc.com/upload/public/pdf/source/20240320/FAC3FEC40A78BC5CCCE96C232A94D860.pdf; Supplier: LCSC; Convert to PCB: yes; Value: 22uF
C96-C98 C101 C104 = C0402: as C1 on sheet INPUT_POWER; Device: GRM155R71H104KE14D; LCSC Part Name: 100nF ±10% 50V; Supplier Part: C77020; Manufacturer Part: GRM155R71H104KE14D; Supplier Footprint: 0402; JLCPCB Part Class: 扩展库; Datasheet: https://atta.szlcsc.com/upload/public/pdf/source/20180326/C77020_39BD49C951FF1AF0DB1F1FAC5AC1E401.pdf; Supplier: LCSC; Convert to PCB: yes; Value: 100nF
C99 C100 C102 C103 = C0402: as C2 on sheet INPUT_POWER; Device: GRM155R71H104KE14D; LCSC Part Name: 100nF ±10% 50V; Supplier Part: C77020; Manufacturer Part: GRM155R71H104KE14D; Supplier Footprint: 0402; JLCPCB Part Class: 扩展库; Datasheet: https://atta.szlcsc.com/upload/public/pdf/source/20180326/C77020_39BD49C951FF1AF0DB1F1FAC5AC1E401.pdf; Supplier: LCSC; Convert to PCB: yes
R46-R54 = R0402: as R1 on sheet INPUT_POWER; Device: 0402WGF1001TCE; LCSC Part Name: 1kΩ ±1% 62.5mW 厚膜电阻; Supplier Part: C11702; Manufacturer Part: 0402WGF1001TCE; Supplier Footprint: 0402; JLCPCB Part Class: 基础库; Datasheet: https://atta.szlcsc.com/upload/public/pdf/source/20200306/C422600_1E6D84923E4A46A82E41ADD87F860B5C.pdf; Supplier: LCSC; Convert to PCB: yes; Type: 厚膜电阻; Temperature Coefficient: ±100ppm/℃; Operating Temperature Range: -55℃~+155℃
U6 = MCIMX6Y2CVM05AB: as U6 on sheet INPUT_POWER; Symbol: MCIMX6Y2CVM05AB; Device: MCIMX6Y2CVM05AB; LCSC Part Name: MCIMX6Y2CVM05AB; Supplier Part: C394783; Manufacturer Part: MCIMX6Y2CVM05AB; Supplier Footprint: MAPBGA-289(14x14); JLCPCB Part Class: 扩展库; Datasheet: https://atta.szlcsc.com/upload/public/pdf/source/20190903/C414057_F91A491E37DFDD32A6FE61E7D0CA74B1.pdf; Supplier: LCSC; Convert to PCB: yes; CPU Core: ARM-A系列; GPIO Ports Number: -; Operating Voltage Range: -; Program Memory Type: -; Operating Temperature Range: -40℃~+105℃; DAC (Bit): -; PWM (Bit): -; 8Bit Timer: -; 16Bit Timer: -; 32Bit Timer: -; CAN: -; I2S: -; SPI: 4; Internal Comparator: -; communication protocol: -; Watchdog: -; Real-Time Clock: -; Infrared Data Association: -; Low-Voltage Detect: -; CCP Capture/Compare: -; LCD Module: 有; LED Module: -; Secure Digital Input and Output: -; Direct Memory Access: -; Internal Oscillator: -; Application Area: -

## Sheet UART_CONTROL.SchDoc
size A4; SheetNumber: 5; SheetTotal: 5
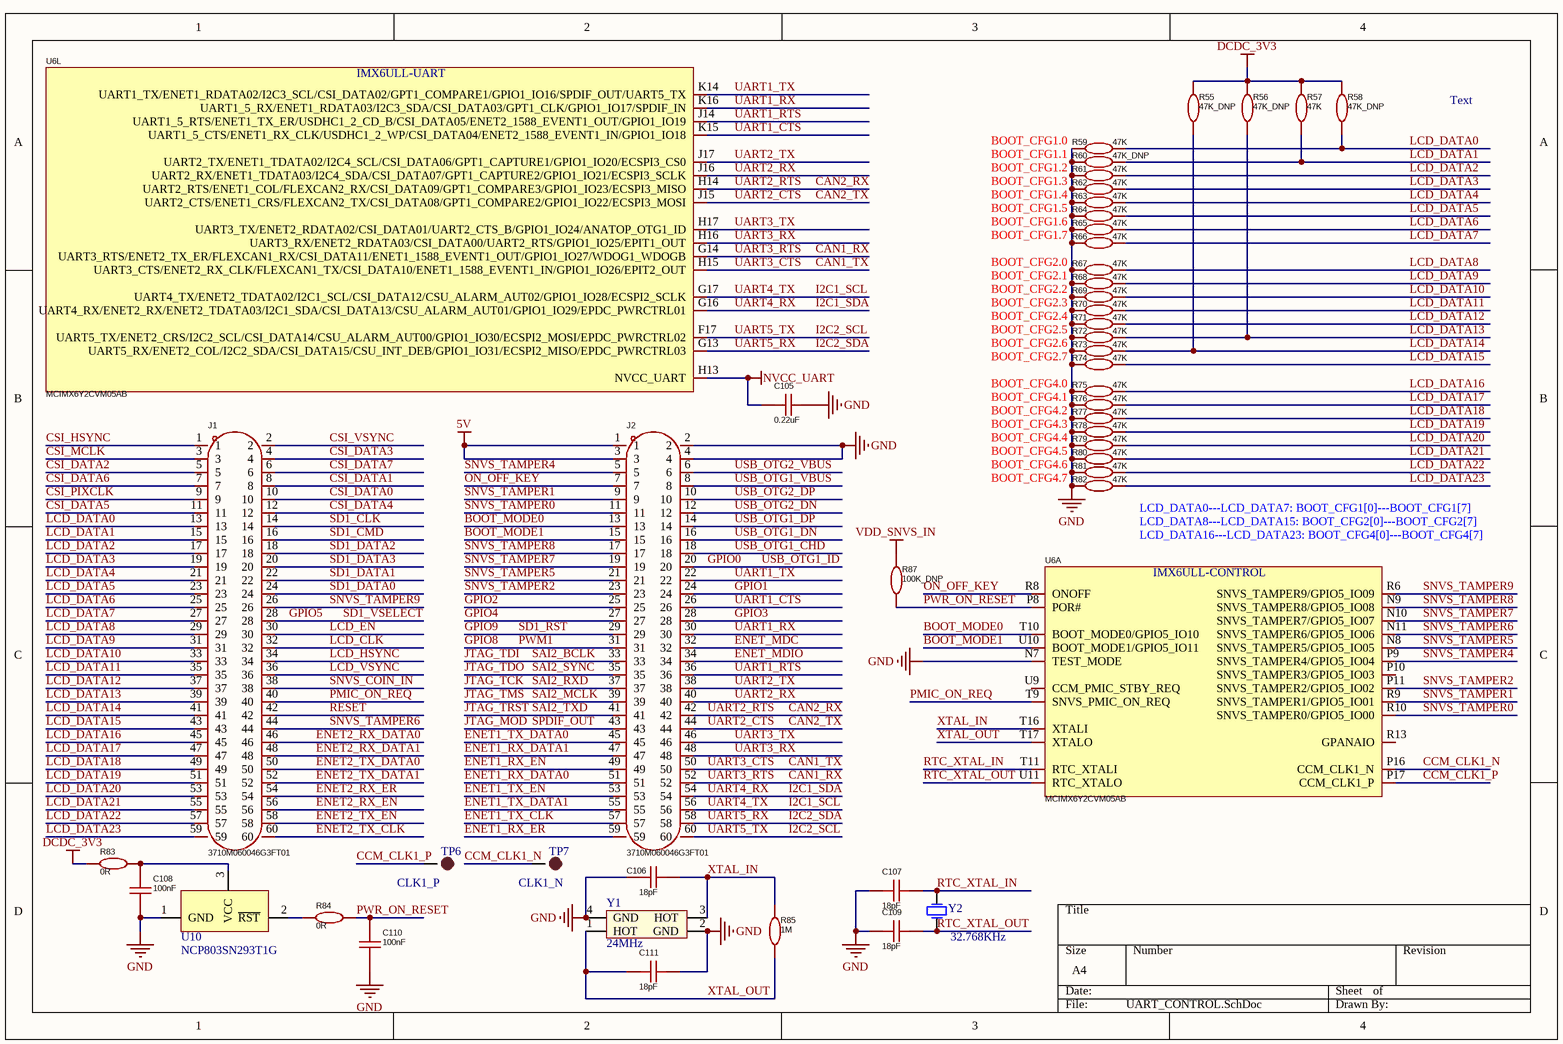
[diagram p4: UART_CONTROL.SchDoc]

### Parts
C105  0.22uF  [C0402]
C106  18pF  [C0402]
C107  18pF  [C0402]
C108  100nF  [C0402]
C109  18pF  [C0402]
C110  100nF  [C0402]
C111  18pF  [C0402]
J1  3710M060046G3FT01  [CONN-SMD_60P-P0.80_3710M060046G3FT01]
J2  3710M060046G3FT01  [CONN-SMD_60P-P0.80_3710M060046G3FT01]
R55  47K_DNP  [R0402]
R56  47K_DNP  [R0402]
R57  47K  [R0402]
R58  47K_DNP  [R0402]
R59  47K  [R0402]
R60  47K_DNP  [R0402]
R61  47K  [R0402]
R62  47K  [R0402]
R63  47K  [R0402]
R64  47K  [R0402]
R65  47K  [R0402]
R66  47K  [R0402]
R67  47K  [R0402]
R68  47K  [R0402]
R69  47K  [R0402]
R70  47K  [R0402]
R71  47K  [R0402]
R72  47K  [R0402]
R73  47K  [R0402]
R74  47K  [R0402]
R75  47K  [R0402]
R76  47K  [R0402]
R77  47K  [R0402]
R78  47K  [R0402]
R79  47K  [R0402]
R80  47K  [R0402]
R81  47K  [R0402]
R82  47K  [R0402]
R83  0R  [R0402]
R84  0R  [R0402]
R85  1M  [R0402]
R87  100K_DNP  [R0402]
TP6  CLK1_P  [TP-1.0]
TP7  CLK1_N  [TP-1.0]
U6  MCIMX6Y2CVM05AB  [BGA-289_L14.0-W14.0-R17-C17-P0.80-BL]  (parts A,L of 12)
U10  NCP803SN293T1G  [SOT23-3L]
Y1  24MHz  [XTAL-3225]
Y2  32.768KHz  [XTAL-3215]

### Nets
5V: J2.1 J2.3
DCDC_3V3: C105.2 R55.2 R56.2 R57.2 R58.2 R83.1 U6.H13(NVCC_UART)  [also labelled NVCC_UART]
GND: C105.1 C106.2 C107.2 C108.1 C109.2 C110.1 C111.1 J2.2 J2.4 R59.1 R60.1 R61.1 R62.1 R63.1 R64.1 R65.1 R66.1 R67.1 R68.1 R69.1 R70.1 R71.1 R72.1 R73.1 R74.1 R75.1 R76.1 R77.1 R78.1 R79.1 R80.1 R81.1 R82.1 U6.N7(TEST_MODE) U10.1(GND) Y1.2(GND) Y1.4(GND)
VDD_SNVS_IN: R87.2  [project net SNVS_IN]
BOOT_MODE0: J2.13 U6.T10(BOOT_MODE0/GPIO5_IO10)
BOOT_MODE1: J2.15 U6.U10(BOOT_MODE1/GPIO5_IO11)
CAN1_RX: J2.52 U6.G14(UART3_RTS/ENET2_TX_ER/FLEXCAN1_RX/CSI_DATA11/ENET1_1588_EVENT1_OUT/GPIO1_IO27/WDOG1_WDOGB)  [also labelled UART3_RTS]
CAN1_TX: J2.50 U6.H15(UART3_CTS/ENET2_RX_CLK/FLEXCAN1_TX/CSI_DATA10/ENET1_1588_EVENT1_IN/GPIO1_IO26/EPIT2_OUT)  [also labelled UART3_CTS]
CAN2_RX: J2.42 U6.H14(UART2_RTS/ENET1_COL/FLEXCAN2_RX/CSI_DATA09/GPT1_COMPARE3/GPIO1_IO23/ECSPI3_MISO)  [also labelled UART2_RTS]
CAN2_TX: J2.44 U6.J15(UART2_CTS/ENET1_CRS/FLEXCAN2_TX/CSI_DATA08/GPT1_COMPARE2/GPIO1_IO22/ECSPI3_MOSI)  [also labelled UART2_CTS]
CCM_CLK1_N: TP7.1 U6.P16(CCM_CLK1_N)
CCM_CLK1_P: TP6.1 U6.P17(CCM_CLK1_P)
CSI_DATA0: J1.10
CSI_DATA1: J1.8
CSI_DATA2: J1.5
CSI_DATA3: J1.4
CSI_DATA4: J1.12
CSI_DATA5: J1.11
CSI_DATA6: J1.7
CSI_DATA7: J1.6
CSI_HSYNC: J1.1
CSI_MCLK: J1.3
CSI_PIXCLK: J1.9
CSI_VSYNC: J1.2
ENET1_RX_DATA0: J2.51
ENET1_RX_DATA1: J2.47
ENET1_RX_EN: J2.49
ENET1_RX_ER: J2.59
ENET1_TX_CLK: J2.57
ENET1_TX_DATA0: J2.45
ENET1_TX_DATA1: J2.55
ENET1_TX_EN: J2.53
ENET2_RX_DATA0: J1.46
ENET2_RX_DATA1: J1.48
ENET2_RX_EN: J1.56
ENET2_RX_ER: J1.54  [project net ECSPI4_SS]
ENET2_TX_CLK: J1.60  [project net ECSPI4_MISO]
ENET2_TX_DATA0: J1.50
ENET2_TX_DATA1: J1.52  [project net ECSPI4_SCLK]
ENET2_TX_EN: J1.58  [project net ECSPI4_MOSI]
ENET_MDC: J2.32
ENET_MDIO: J2.34
GPIO0: J2.20  [also labelled USB_OTG1_ID]
GPIO1: J2.24
GPIO2: J2.25
GPIO3: J2.28
GPIO4: J2.27
GPIO5: J1.28  [also labelled SD1_VSELECT]
GPIO8: J2.31  [also labelled PWM1]
GPIO9: J2.29  [also labelled SD1_RST]
I2C1_SCL: J2.56 U6.G17(UART4_TX/ENET2_TDATA02/I2C1_SCL/CSI_DATA12/CSU_ALARM_AUT02/GPIO1_IO28/ECSPI2_SCLK)  [also labelled UART4_TX]
I2C1_SDA: J2.54 U6.G16(UART4_RX/ENET2_RX/ENET2_TDATA03/I2C1_SDA/CSI_DATA13/CSU_ALARM_AUT01/GPIO1_IO29/EPDC_PWRCTRL01)  [also labelled UART4_RX]
I2C2_SCL: J2.60 U6.F17(UART5_TX/ENET2_CRS/I2C2_SCL/CSI_DATA14/CSU_ALARM_AUT00/GPIO1_IO30/ECSPI2_MOSI/EPDC_PWRCTRL02)  [also labelled UART5_TX]
I2C2_SDA: J2.58 U6.G13(UART5_RX/ENET2_COL/I2C2_SDA/CSI_DATA15/CSU_INT_DEB/GPIO1_IO31/ECSPI2_MISO/EPDC_PWRCTRL03)  [also labelled UART5_RX]
JTAG_MOD: J2.43  [also labelled SPDIF_OUT]
JTAG_TCK: J2.37  [also labelled SAI2_RXD]
JTAG_TDI: J2.33  [also labelled SAI2_BCLK]
JTAG_TDO: J2.35  [also labelled SAI2_SYNC]
JTAG_TMS: J2.39  [also labelled SAI2_MCLK]
JTAG_TRST: J2.41  [also labelled SAI2_TXD]
LCD_CLK: J1.32
LCD_DATA0: J1.13 R58.1 R59.2
LCD_DATA1: J1.15 R57.1 R60.2
LCD_DATA2: J1.17 R61.2
LCD_DATA3: J1.19 R62.2
LCD_DATA4: J1.21 R63.2
LCD_DATA5: J1.23 R64.2
LCD_DATA6: J1.25 R65.2
LCD_DATA7: J1.27 R66.2
LCD_DATA8: J1.29 R67.2
LCD_DATA9: J1.31 R68.2
LCD_DATA10: J1.33 R69.2
LCD_DATA11: J1.35 R70.2
LCD_DATA12: J1.37 R71.2
LCD_DATA13: J1.39 R56.1 R72.2
LCD_DATA14: J1.41 R55.1 R73.2
LCD_DATA15: J1.43 R74.2
LCD_DATA16: J1.45 R75.2
LCD_DATA17: J1.47 R76.2
LCD_DATA18: J1.49 R77.2
LCD_DATA19: J1.51 R78.2
LCD_DATA20: J1.53 R79.2
LCD_DATA21: J1.55 R80.2
LCD_DATA22: J1.57 R81.2
LCD_DATA23: J1.59 R82.2
LCD_EN: J1.30
LCD_HSYNC: J1.34
LCD_VSYNC: J1.36
ON_OFF_KEY: J2.7 U6.R8(ONOFF)
PMIC_ON_REQ: J1.40 U6.T9(SNVS_PMIC_ON_REQ)
PWR_ON_RESET: C110.2 R84.2 R87.1 U6.P8(POR#)
RESET: J1.42
RTC_XTAL_IN: C107.1 U6.T11(RTC_XTALI) Y2.2(OSC2)
RTC_XTAL_OUT: C109.1 U6.U11(RTC_XTALO) Y2.1(OSC1)
SD1_CLK: J1.14
SD1_CMD: J1.16
SD1_DATA0: J1.24
SD1_DATA1: J1.22
SD1_DATA2: J1.18
SD1_DATA3: J1.20
SNVS_COIN_IN: J1.38
SNVS_TAMPER0: J2.11 U6.R10(SNVS_TAMPER0/GPIO5_IO00)
SNVS_TAMPER1: J2.9 U6.R9(SNVS_TAMPER1/GPIO5_IO01)
SNVS_TAMPER2: J2.23 U6.P11(SNVS_TAMPER2/GPIO5_IO02)
SNVS_TAMPER4: J2.5 U6.P9(SNVS_TAMPER4/GPIO5_IO04)
SNVS_TAMPER5: J2.21 U6.N8(SNVS_TAMPER5/GPIO5_IO05)
SNVS_TAMPER6: J1.44 U6.N11(SNVS_TAMPER6/GPIO5_IO06)
SNVS_TAMPER7: J2.19 U6.N10(SNVS_TAMPER7/GPIO5_IO07)
SNVS_TAMPER8: J2.17 U6.N9(SNVS_TAMPER8/GPIO5_IO08)
SNVS_TAMPER9: J1.26 U6.R6(SNVS_TAMPER9/GPIO5_IO09)
UART1_CTS: J2.26 U6.K15(UART1_5_CTS/ENET1_RX_CLK/USDHC1_2_WP/CSI_DATA04/ENET2_1588_EVENT1_IN/GPIO1_IO18)
UART1_RTS: J2.36 U6.J14(UART1_5_RTS/ENET1_TX_ER/USDHC1_2_CD_B/CSI_DATA05/ENET2_1588_EVENT1_OUT/GPIO1_IO19)
UART1_RX: J2.30 U6.K16(UART1_5_RX/ENET1_RDATA03/I2C3_SDA/CSI_DATA03/GPT1_CLK/GPIO1_IO17/SPDIF_IN)
UART1_TX: J2.22 U6.K14(UART1_TX/ENET1_RDATA02/I2C3_SCL/CSI_DATA02/GPT1_COMPARE1/GPIO1_IO16/SPDIF_OUT/UART5_TX)
UART2_RX: J2.40 U6.J16(UART2_RX/ENET1_TDATA03/I2C4_SDA/CSI_DATA07/GPT1_CAPTURE2/GPIO1_IO21/ECSPI3_SCLK)
UART2_TX: J2.38 U6.J17(UART2_TX/ENET1_TDATA02/I2C4_SCL/CSI_DATA06/GPT1_CAPTURE1/GPIO1_IO20/ECSPI3_CS0)
UART3_RX: J2.48 U6.H16(UART3_RX/ENET2_RDATA03/CSI_DATA00/UART2_RTS/GPIO1_IO25/EPIT1_OUT)
UART3_TX: J2.46 U6.H17(UART3_TX/ENET2_RDATA02/CSI_DATA01/UART2_CTS_B/GPIO1_IO24/ANATOP_OTG1_ID)
USB_OTG1_CHD: J2.18
USB_OTG1_DN: J2.16
USB_OTG1_DP: J2.14
USB_OTG1_VBUS: J2.8
USB_OTG2_DN: J2.12
USB_OTG2_DP: J2.10
USB_OTG2_VBUS: J2.6
XTAL_IN: C106.1 R85.2 U6.T16(XTALI) Y1.3(HOT)
XTAL_OUT: C111.2 R85.1 U6.T17(XTALO) Y1.1(HOT)
NetC108_2: C108.2 R83.2 U10.3(VCC)
NetR84_1: R84.1 U10.2(~{RST})

Not connected (* = marked no-connect by the designer): U6 P10(SNVS_TAMPER3/GPIO5_IO03) R13(GPANAIO) U9(CCM_PMIC_STBY_REQ)

### Notes on the sheet
- Text
- BOOT_CFG1.0
- BOOT_CFG1.1
- BOOT_CFG1.2
- BOOT_CFG1.3
- BOOT_CFG1.4
- BOOT_CFG1.5
- BOOT_CFG1.6
- BOOT_CFG1.7
- BOOT_CFG2.0
- BOOT_CFG2.1
- BOOT_CFG2.2
- BOOT_CFG2.3
- BOOT_CFG2.4
- BOOT_CFG2.5
- BOOT_CFG2.6
- BOOT_CFG2.7
- BOOT_CFG4.0
- BOOT_CFG4.1
- BOOT_CFG4.2
- BOOT_CFG4.3
- BOOT_CFG4.4
- BOOT_CFG4.5
- BOOT_CFG4.6
- BOOT_CFG4.7
- LCD_DATA0---LCD_DATA7: BOOT_CFG1[0]---BOOT_CFG1[7]
  LCD_DATA8---LCD_DATA15: BOOT_CFG2[0]---BOOT_CFG2[7]
  LCD_DATA16---LCD_DATA23: BOOT_CFG4[0]---BOOT_CFG4[7]
- (in symbol MCIMX6Y2CVM05AB, part A) IMX6ULL-CONTROL
- (in symbol MCIMX6Y2CVM05AB, part L) IMX6ULL-UART

### Library data of the parts
C105-C107 C109 C111 = C0402: as C2 on sheet INPUT_POWER; Device: GRM155R71H104KE14D; LCSC Part Name: 100nF ±10% 50V; Supplier Part: C77020; Manufacturer Part: GRM155R71H104KE14D; Supplier Footprint: 0402; JLCPCB Part Class: 扩展库; Datasheet: https://atta.szlcsc.com/upload/public/pdf/source/20180326/C77020_39BD49C951FF1AF0DB1F1FAC5AC1E401.pdf; Supplier: LCSC; Convert to PCB: yes
C108 C110 = C0402: as C1 on sheet INPUT_POWER; Device: GRM155R71H104KE14D; LCSC Part Name: 100nF ±10% 50V; Supplier Part: C77020; Manufacturer Part: GRM155R71H104KE14D; Supplier Footprint: 0402; JLCPCB Part Class: 扩展库; Datasheet: https://atta.szlcsc.com/upload/public/pdf/source/20180326/C77020_39BD49C951FF1AF0DB1F1FAC5AC1E401.pdf; Supplier: LCSC; Convert to PCB: yes; Value: 100nF
J1 J2 = 3710M060046G3FT01: Add into BOM: yes; Symbol: 3710M060046G3FT01; Device: 3710M060046G3FT01; LCSC Part Name: 3710M060046G3FT01; Supplier Part: C9900016341; Manufacturer Part: 3710M060046G3FT01; Supplier Footprint: SMD-60; JLCPCB Part Class: 扩展库; Supplier: LCSC; Convert to PCB: yes
R55-R85 R87 = R0402: as R1 on sheet INPUT_POWER; Device: 0402WGF1001TCE; LCSC Part Name: 1kΩ ±1% 62.5mW 厚膜电阻; Supplier Part: C11702; Manufacturer Part: 0402WGF1001TCE; Supplier Footprint: 0402; JLCPCB Part Class: 基础库; Datasheet: https://atta.szlcsc.com/upload/public/pdf/source/20200306/C422600_1E6D84923E4A46A82E41ADD87F860B5C.pdf; Supplier: LCSC; Convert to PCB: yes; Type: 厚膜电阻; Temperature Coefficient: ±100ppm/℃; Operating Temperature Range: -55℃~+155℃
TP6 TP7 = TEST-POINT: 测试点
U6 = MCIMX6Y2CVM05AB: as U6 on sheet INPUT_POWER; Symbol: MCIMX6Y2CVM05AB; Device: MCIMX6Y2CVM05AB; LCSC Part Name: MCIMX6Y2CVM05AB; Supplier Part: C394783; Manufacturer Part: MCIMX6Y2CVM05AB; Supplier Footprint: MAPBGA-289(14x14); JLCPCB Part Class: 扩展库; Datasheet: https://atta.szlcsc.com/upload/public/pdf/source/20190903/C414057_F91A491E37DFDD32A6FE61E7D0CA74B1.pdf; Supplier: LCSC; Convert to PCB: yes; CPU Core: ARM-A系列; GPIO Ports Number: -; Operating Voltage Range: -; Program Memory Type: -; Operating Temperature Range: -40℃~+105℃; DAC (Bit): -; PWM (Bit): -; 8Bit Timer: -; 16Bit Timer: -; 32Bit Timer: -; CAN: -; I2S: -; SPI: 4; Internal Comparator: -; communication protocol: -; Watchdog: -; Real-Time Clock: -; Infrared Data Association: -; Low-Voltage Detect: -; CCP Capture/Compare: -; LCD Module: 有; LED Module: -; Secure Digital Input and Output: -; Direct Memory Access: -; Internal Oscillator: -; Application Area: -
Y1 = XTAL_3225: 3225贴片无源晶振
Y2 = XTAL: 普通晶振; Published: 8-Jun-2000; LatestRevisionDate: 17-Jul-2002; LatestRevisionNote: Re-released for DXP Platform.; Publisher: Altium Limited